# EAGLE schematic xio4 (EAGLE 9.4.2)

## Sheet 1 of 11: Block diagram
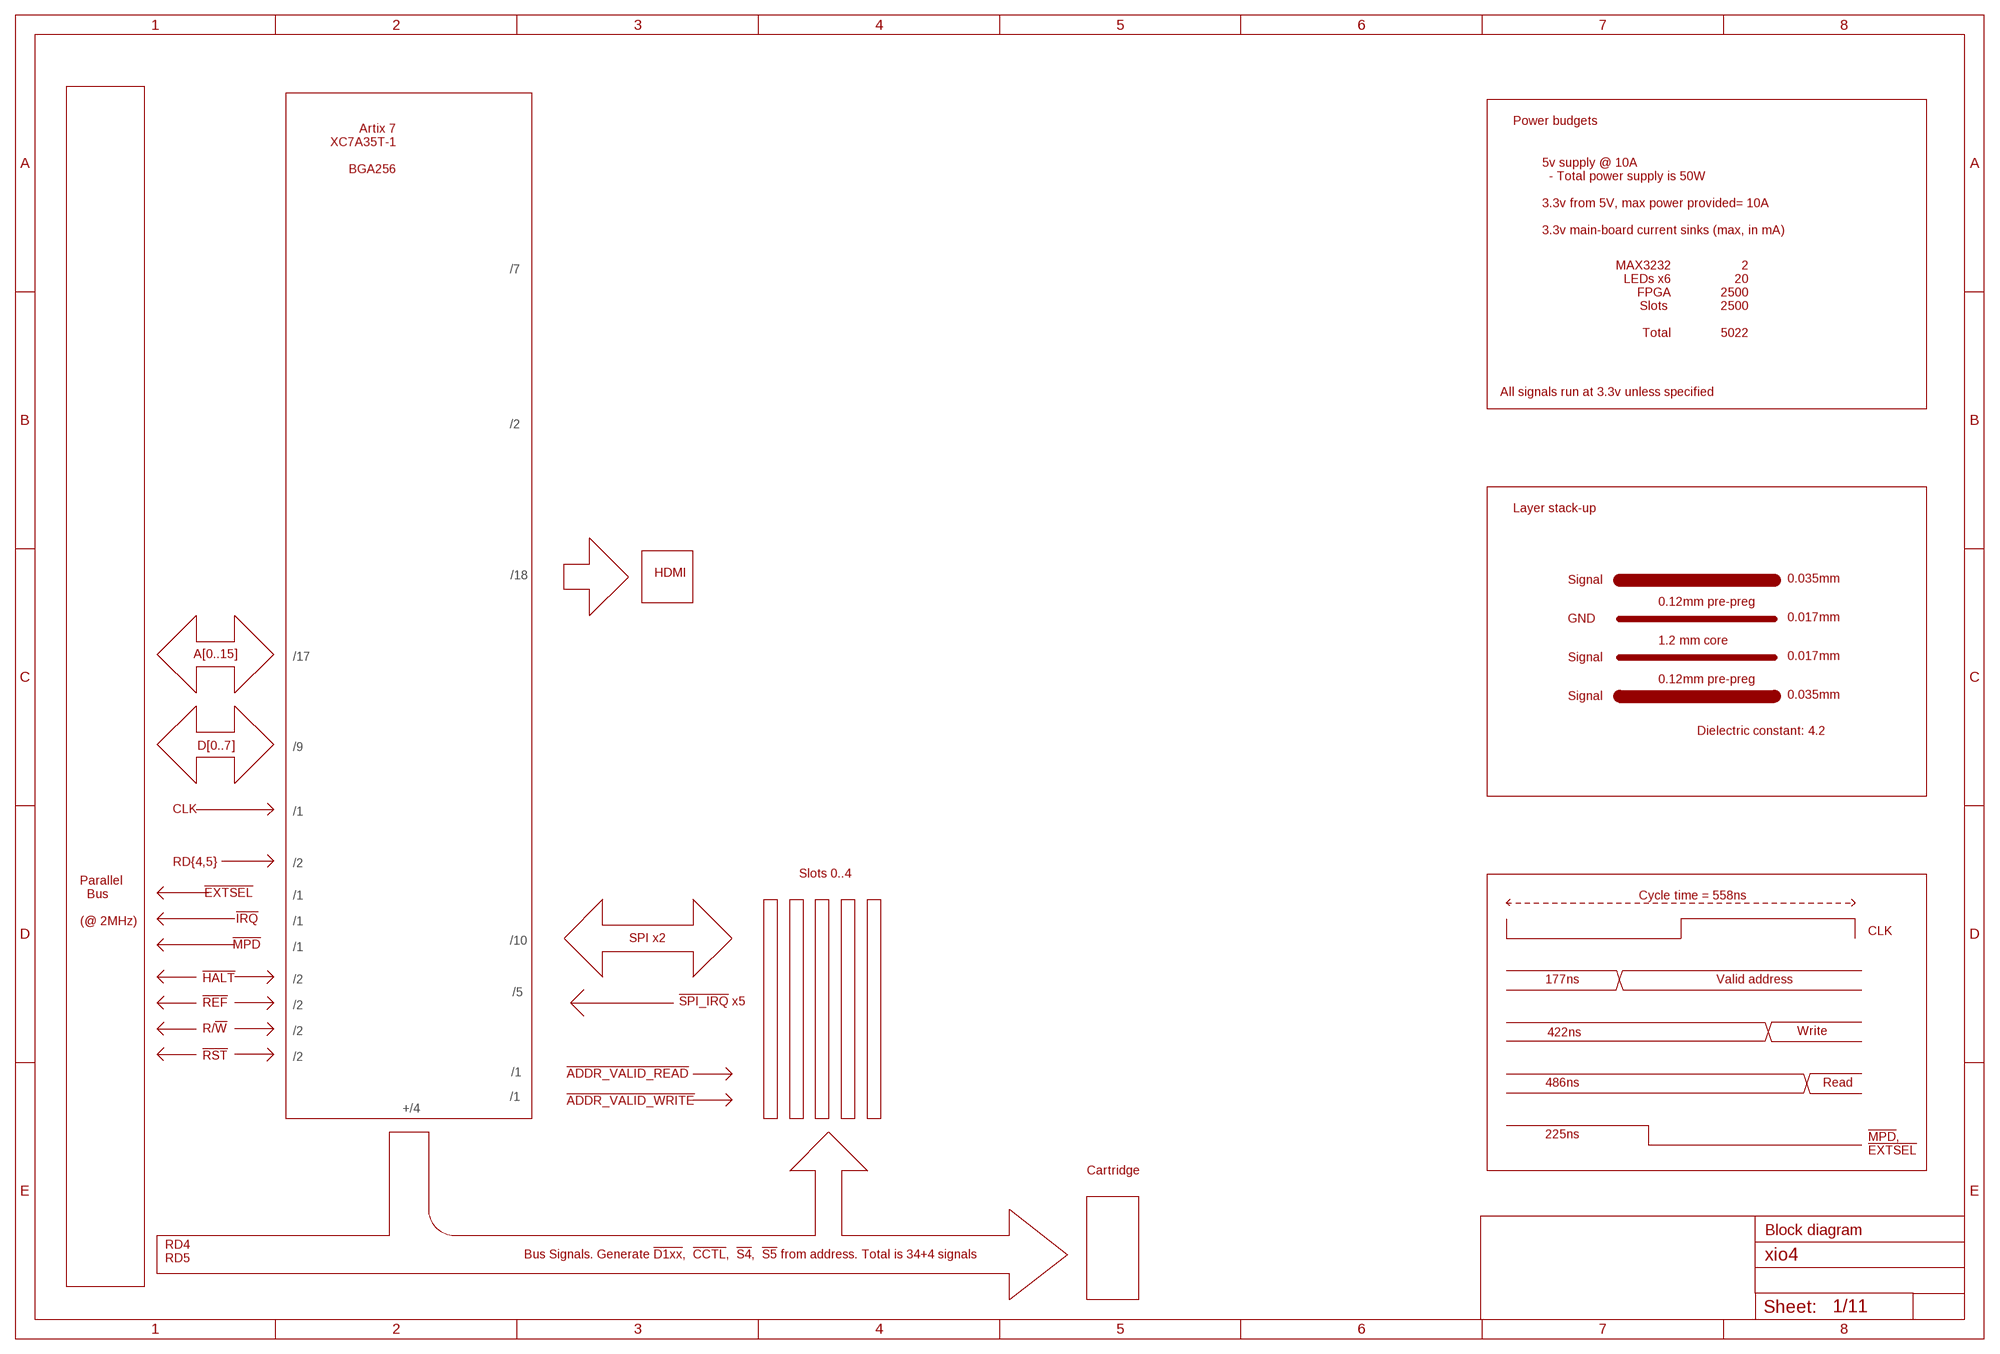
[diagram p0: schematic, sheet 1]

### Notes on the sheet
- Artix 7
      XC7A35T-1
  
   BGA256
- Power budgets
- 5v supply @ 10A
    - Total power supply is 50W
  
  3.3v from 5V, max power provided= 10A 
  
  3.3v main-board current sinks (max, in mA)
- MAX3232
  LEDs x6
  FPGA
  Slots 
  
  Total
- 2
  20
  2500
  2500
  
  5022
- /7
- All signals run at 3.3v unless specified
- /2
- Layer stack-up
- /18
- HDMI
- Signal | 0.035mm
- 0.12mm pre-preg
- GND | 0.017mm
- 1.2 mm core
- A[0..15] | /17 | Signal | 0.017mm
- 0.12mm pre-preg
- Signal | 0.035mm
- Dielectric constant: 4.2
- D[0..7] | /9
- CLK | /1
- RD{4,5} | /2
- Slots 0..4
- !EXTSEL!
- /1 | Cycle time = 558ns
- !IRQ!
- Parallel
    Bus
  
  (@ 2MHz)
- /1
- CLK
- !MPD! | SPI x2
- /10
- /1
- !HALT! | /2 | 177ns | Valid address
- /5
- !REF! | !SPI_IRQ! x5
- /2
- R/!W! | /2 | Write
- 422ns
- !RST! | /2
- /1 | !ADDR_VALID_READ!
- 486ns | Read
- /1
- !ADDR_VALID_WRITE!
- +/4
- 225ns
- !MPD!,
  !EXTSEL!
- Cartridge
- Block diagram
- Bus Signals. Generate !D1xx!,  !CCTL!,  !S4!,  !S5! from address. Total is 34+4 signals
- RD4
  RD5

## Sheet 2 of 11: High voltage signalling
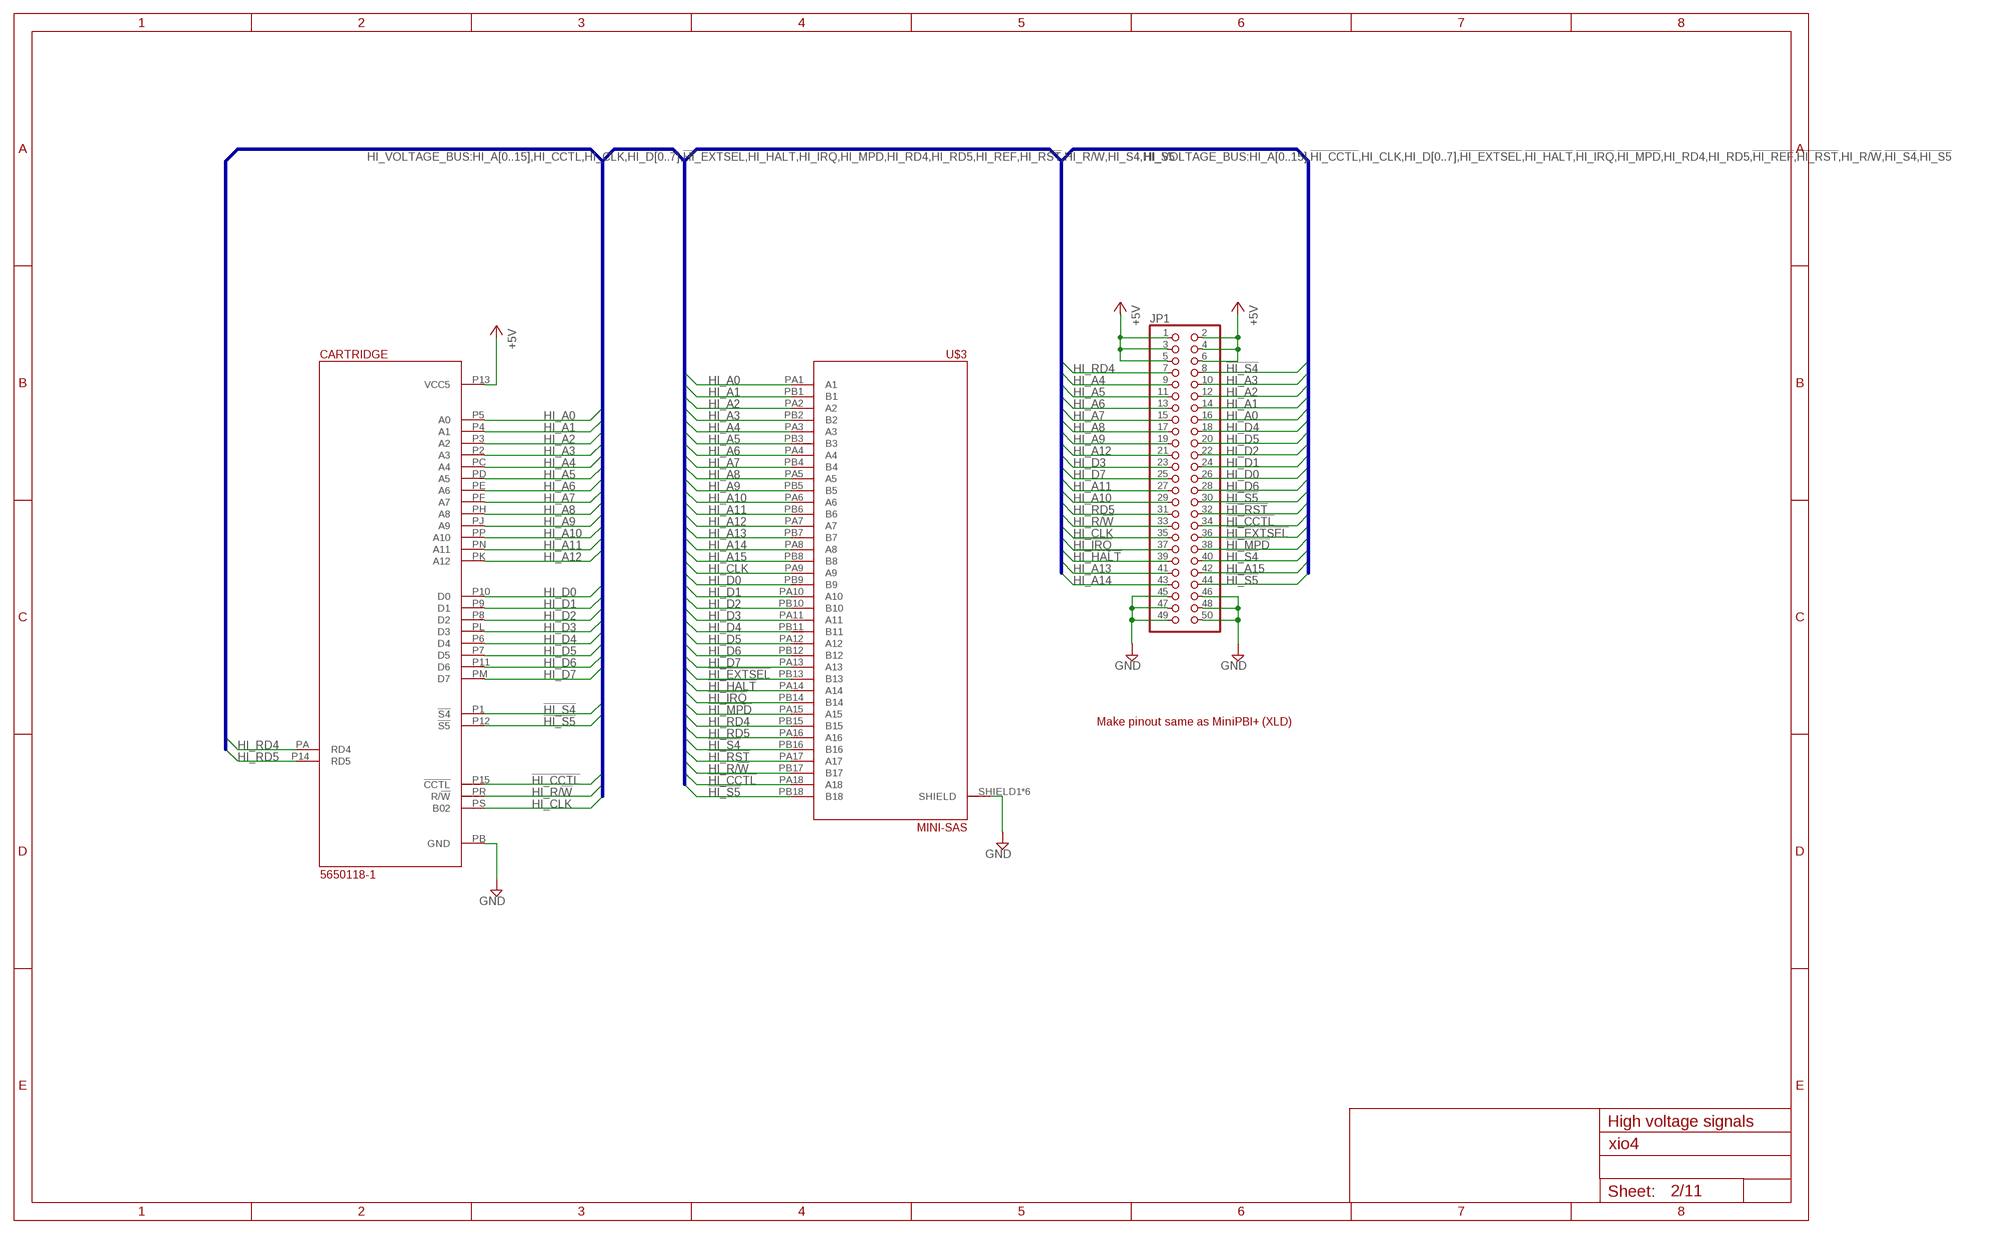
[diagram p1: schematic, sheet 2]

### Parts
CARTRIDGE  5650118-1  A8_CART  [A8_CART]
JP1  PINHD-2X25  [2X25]
U$3  MINI-SAS  [MINI-SAS]

### Nets
!HI_CCTL!: CARTRIDGE.P15(!CCTL!) JP1.34 U$3.PA18(A18)
!HI_EXTSEL!: JP1.36 U$3.PB13(B13) ; also sheet 3
!HI_HALT!: JP1.39 U$3.PA14(A14) ; also sheet 3
!HI_IRQ!: JP1.37 U$3.PB14(B14) ; also sheet 3
!HI_MPD!: JP1.38 U$3.PA15(A15) ; also sheet 3
!HI_RST!: JP1.32 U$3.PA17(A17) ; also sheet 3
!HI_S4!: CARTRIDGE.P1(!S4!) JP1.8 JP1.40 U$3.PB16(B16)
!HI_S5!: CARTRIDGE.P12(!S5!) JP1.30 JP1.44 U$3.PB18(B18)
+5V [Power]: CARTRIDGE.P13(VCC5) JP1.1 JP1.2 JP1.3 JP1.4 JP1.5 JP1.6 ; also sheet 3,4,5,6,7
GND: CARTRIDGE.PB(GND) JP1.45 JP1.46 JP1.47 JP1.48 JP1.49 JP1.50 U$3.SHIELD1(SHIELD) U$3.SHIELD2(SHIELD) U$3.SHIELD3(SHIELD) U$3.SHIELD4(SHIELD) U$3.SHIELD5(SHIELD) U$3.SHIELD6(SHIELD) ; also sheet 3,4,5,6,7,9
HI_A0: CARTRIDGE.P5(A0) JP1.16 U$3.PA1(A1) ; also sheet 3
HI_A1: CARTRIDGE.P4(A1) JP1.14 U$3.PB1(B1) ; also sheet 3
HI_A2: CARTRIDGE.P3(A2) JP1.12 U$3.PA2(A2) ; also sheet 3
HI_A3: CARTRIDGE.P2(A3) JP1.10 U$3.PB2(B2) ; also sheet 3
HI_A4: CARTRIDGE.PC(A4) JP1.9 U$3.PA3(A3) ; also sheet 3
HI_A5: CARTRIDGE.PD(A5) JP1.11 U$3.PB3(B3) ; also sheet 3
HI_A6: CARTRIDGE.PE(A6) JP1.13 U$3.PA4(A4) ; also sheet 3
HI_A7: CARTRIDGE.PF(A7) JP1.15 U$3.PB4(B4) ; also sheet 3
HI_A8: CARTRIDGE.PH(A8) JP1.17 U$3.PA5(A5) ; also sheet 3
HI_A9: CARTRIDGE.PJ(A9) JP1.19 U$3.PB5(B5) ; also sheet 3
HI_A10: CARTRIDGE.PP(A10) JP1.29 U$3.PA6(A6) ; also sheet 3
HI_A11: CARTRIDGE.PN(A11) JP1.27 U$3.PB6(B6) ; also sheet 3
HI_A12: CARTRIDGE.PK(A12) JP1.21 U$3.PA7(A7) ; also sheet 3
HI_A13: JP1.41 U$3.PB7(B7) ; also sheet 3
HI_A14: JP1.43 U$3.PA8(A8) ; also sheet 3
HI_A15: JP1.42 U$3.PB8(B8) ; also sheet 3
HI_CLK: CARTRIDGE.PS(B02) JP1.35 U$3.PA9(A9) ; also sheet 3
HI_D0: CARTRIDGE.P10(D0) JP1.26 U$3.PB9(B9) ; also sheet 3
HI_D1: CARTRIDGE.P9(D1) JP1.24 U$3.PA10(A10) ; also sheet 3
HI_D2: CARTRIDGE.P8(D2) JP1.22 U$3.PB10(B10) ; also sheet 3
HI_D3: CARTRIDGE.PL(D3) JP1.23 U$3.PA11(A11) ; also sheet 3
HI_D4: CARTRIDGE.P6(D4) JP1.18 U$3.PB11(B11) ; also sheet 3
HI_D5: CARTRIDGE.P7(D5) JP1.20 U$3.PA12(A12) ; also sheet 3
HI_D6: CARTRIDGE.P11(D6) JP1.28 U$3.PB12(B12) ; also sheet 3
HI_D7: CARTRIDGE.PM(D7) JP1.25 U$3.PA13(A13) ; also sheet 3
HI_R/!W!: CARTRIDGE.PR(R/!W!) JP1.33 U$3.PB17(B17) ; also sheet 3
HI_RD4: CARTRIDGE.PA(RD4) JP1.7 U$3.PB15(B15) ; also sheet 3
HI_RD5: CARTRIDGE.P14(RD5) JP1.31 U$3.PA16(A16) ; also sheet 3

### Buses
HI_VOLTAGE_BUS:HI_A[0..15],!HI_CCTL!,HI_CLK,HI_D[0..7],!HI_EXTSEL!,!HI_HALT!,!HI_IRQ!,!HI_MPD!,HI_RD4,HI_RD5,!HI_REF!,!HI_RST!,HI_R/!W!,!HI_S4!,!HI_S5!

### Notes on the sheet
- Make pinout same as MiniPBI+ (XLD)
- High voltage signals

## Sheet 3 of 11: Level changers
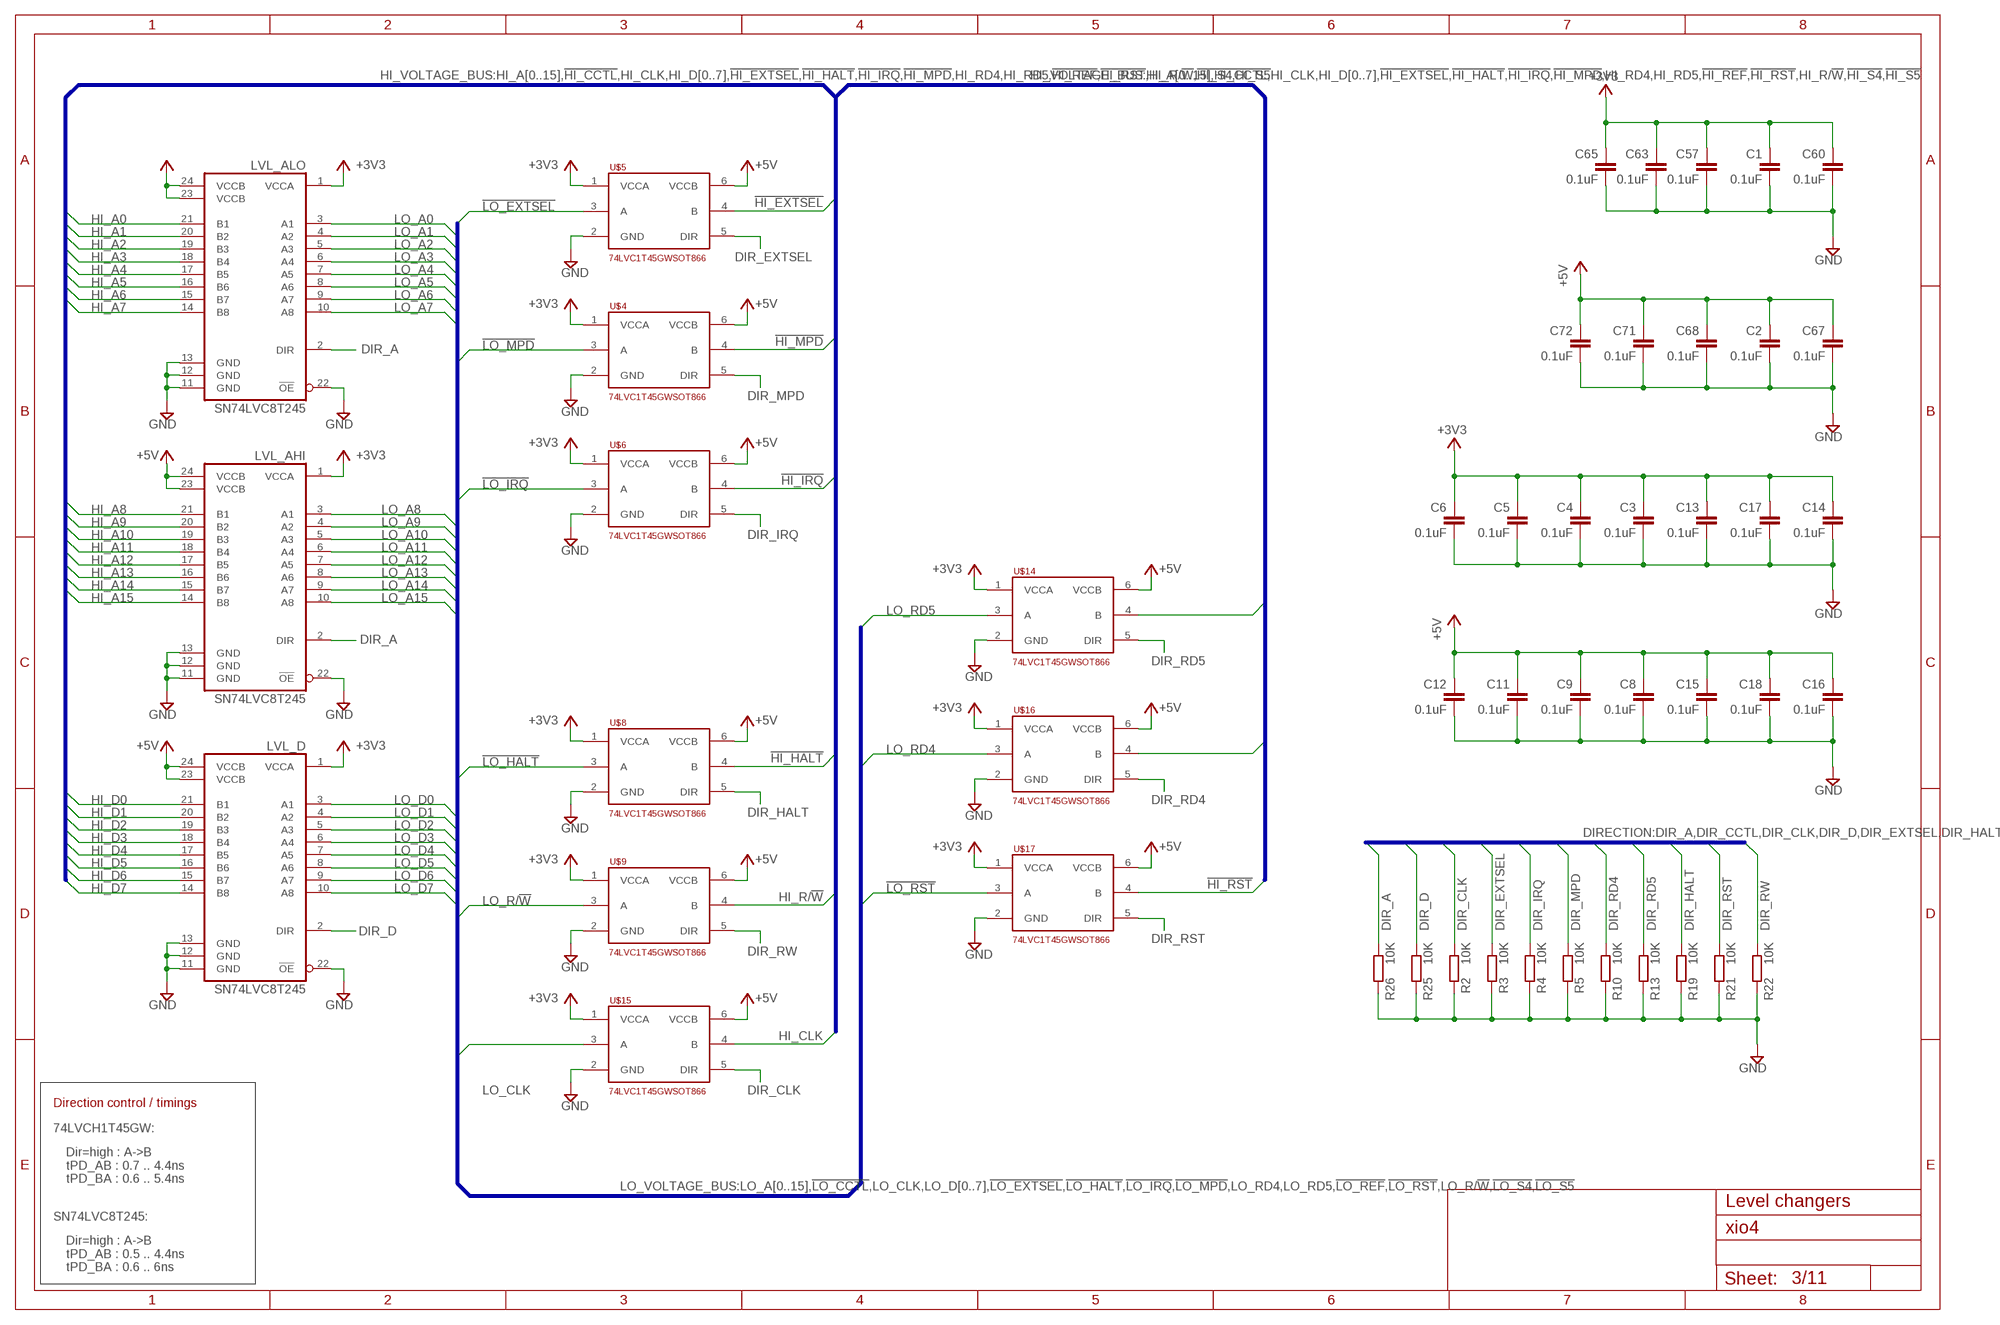
[diagram p2: schematic, sheet 3, part 1 of 2]
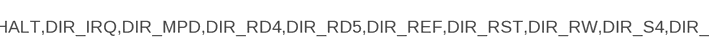
[diagram p3: schematic, sheet 3, part 2 of 2]

### Parts
C1  0.1uF  C-EUC0201  [C0201]
C2  0.1uF  C-EUC0201  [C0201]
C3  0.1uF  C-EUC0201  [C0201]
C4  0.1uF  C-EUC0201  [C0201]
C5  0.1uF  C-EUC0201  [C0201]
C6  0.1uF  C-EUC0201  [C0201]
C8  0.1uF  C-EUC0201  [C0201]
C9  0.1uF  C-EUC0201  [C0201]
C11  0.1uF  C-EUC0201  [C0201]
C12  0.1uF  C-EUC0201  [C0201]
C13  0.1uF  C-EUC0201  [C0201]
C14  0.1uF  C-EUC0201  [C0201]
C15  0.1uF  C-EUC0201  [C0201]
C16  0.1uF  C-EUC0201  [C0201]
C17  0.1uF  C-EUC0201  [C0201]
C18  0.1uF  C-EUC0201  [C0201]
C57  0.1uF  C-EUC0201  [C0201]
C60  0.1uF  C-EUC0201  [C0201]
C63  0.1uF  C-EUC0201  [C0201]
C65  0.1uF  C-EUC0201  [C0201]
C67  0.1uF  C-EUC0201  [C0201]
C68  0.1uF  C-EUC0201  [C0201]
C71  0.1uF  C-EUC0201  [C0201]
C72  0.1uF  C-EUC0201  [C0201]
LVL_AHI  SN74LVC8T245  [TSSOP24]
LVL_ALO  SN74LVC8T245  [TSSOP24]
LVL_D  SN74LVC8T245  [TSSOP24]
R2  10K  R-EU_R0201  [R0201]
R3  10K  R-EU_R0201  [R0201]
R4  10K  R-EU_R0201  [R0201]
R5  10K  R-EU_R0201  [R0201]
R10  10K  R-EU_R0201  [R0201]
R13  10K  R-EU_R0201  [R0201]
R19  10K  R-EU_R0201  [R0201]
R21  10K  R-EU_R0201  [R0201]
R22  10K  R-EU_R0201  [R0201]
R25  10K  R-EU_R0201  [R0201]
R26  10K  R-EU_R0201  [R0201]
U$4  74LVC1T45GWSOT866  [SOT886]
U$5  74LVC1T45GWSOT866  [SOT886]
U$6  74LVC1T45GWSOT866  [SOT886]
U$8  74LVC1T45GWSOT866  [SOT886]
U$9  74LVC1T45GWSOT866  [SOT886]
U$14  74LVC1T45GWSOT866  [SOT886]
U$15  74LVC1T45GWSOT866  [SOT886]
U$16  74LVC1T45GWSOT866  [SOT886]
U$17  74LVC1T45GWSOT866  [SOT886]

### Nets
!HI_EXTSEL!: U$5.4(B) ; also sheet 2
!HI_HALT!: U$8.4(B) ; also sheet 2
!HI_IRQ!: U$6.4(B) ; also sheet 2
!HI_MPD!: U$4.4(B) ; also sheet 2
!HI_RST!: U$17.4(B) ; also sheet 2
!LO_EXTSEL!: U$5.3(A) ; also sheet 5,6,7
!LO_HALT!: U$8.3(A) ; also sheet 5,6,7
!LO_IRQ!: U$6.3(A) ; also sheet 5,6,7
!LO_MPD!: U$4.3(A) ; also sheet 5,6,7
!LO_RST!: U$17.3(A) ; also sheet 5,6,7
+3V3 [lcd]: C1.1 C3.1 C4.1 C5.1 C6.1 C13.1 C14.1 C17.1 C57.1 C60.1 C63.1 C65.1 LVL_AHI.1(VCCA) LVL_ALO.1(VCCA) LVL_D.1(VCCA) U$4.1(VCCA) U$5.1(VCCA) U$6.1(VCCA) U$8.1(VCCA) U$9.1(VCCA) U$14.1(VCCA) U$15.1(VCCA) U$16.1(VCCA) U$17.1(VCCA) ; also sheet 4,5,6,7,9
+5V [Power]: C2.1 C8.1 C9.1 C11.1 C12.1 C15.1 C16.1 C18.1 C67.1 C68.1 C71.1 C72.1 LVL_AHI.23(VCCB) LVL_AHI.24(VCCB) LVL_ALO.23(VCCB) LVL_ALO.24(VCCB) LVL_D.23(VCCB) LVL_D.24(VCCB) U$4.6(VCCB) U$5.6(VCCB) U$6.6(VCCB) U$8.6(VCCB) U$9.6(VCCB) U$14.6(VCCB) U$15.6(VCCB) U$16.6(VCCB) U$17.6(VCCB) ; also sheet 2,4,5,6,7
DIR_A: LVL_AHI.2(DIR) LVL_ALO.2(DIR) R26.1
DIR_CLK: R2.1 U$15.5(DIR)
DIR_D: LVL_D.2(DIR) R25.1
DIR_EXTSEL: R3.1 U$5.5(DIR)
DIR_HALT: R19.1 U$8.5(DIR)
DIR_IRQ: R4.1 U$6.5(DIR)
DIR_MPD: R5.1 U$4.5(DIR)
DIR_RD4: R10.1 U$16.5(DIR)
DIR_RD5: R13.1 U$14.5(DIR)
DIR_RST: R21.1 U$17.5(DIR)
DIR_RW: R22.1 U$9.5(DIR)
GND: C1.2 C2.2 C3.2 C4.2 C5.2 C6.2 C8.2 C9.2 C11.2 C12.2 C13.2 C14.2 C15.2 C16.2 C17.2 C18.2 C57.2 C60.2 C63.2 C65.2 C67.2 C68.2 C71.2 C72.2 LVL_AHI.11(GND) LVL_AHI.12(GND) LVL_AHI.13(GND) LVL_AHI.22(!OE!) LVL_ALO.11(GND) LVL_ALO.12(GND) LVL_ALO.13(GND) LVL_ALO.22(!OE!) LVL_D.11(GND) LVL_D.12(GND) LVL_D.13(GND) LVL_D.22(!OE!) R2.2 R3.2 R4.2 R5.2 R10.2 R13.2 R19.2 R21.2 R22.2 R25.2 R26.2 U$4.2(GND) U$5.2(GND) U$6.2(GND) U$8.2(GND) U$9.2(GND) U$14.2(GND) U$15.2(GND) U$16.2(GND) U$17.2(GND) ; also sheet 2,4,5,6,7,9
HI_A0: LVL_ALO.21(B1) ; also sheet 2
HI_A1: LVL_ALO.20(B2) ; also sheet 2
HI_A2: LVL_ALO.19(B3) ; also sheet 2
HI_A3: LVL_ALO.18(B4) ; also sheet 2
HI_A4: LVL_ALO.17(B5) ; also sheet 2
HI_A5: LVL_ALO.16(B6) ; also sheet 2
HI_A6: LVL_ALO.15(B7) ; also sheet 2
HI_A7: LVL_ALO.14(B8) ; also sheet 2
HI_A8: LVL_AHI.21(B1) ; also sheet 2
HI_A9: LVL_AHI.20(B2) ; also sheet 2
HI_A10: LVL_AHI.19(B3) ; also sheet 2
HI_A11: LVL_AHI.18(B4) ; also sheet 2
HI_A12: LVL_AHI.17(B5) ; also sheet 2
HI_A13: LVL_AHI.16(B6) ; also sheet 2
HI_A14: LVL_AHI.15(B7) ; also sheet 2
HI_A15: LVL_AHI.14(B8) ; also sheet 2
HI_CLK: U$15.4(B) ; also sheet 2
HI_D0: LVL_D.21(B1) ; also sheet 2
HI_D1: LVL_D.20(B2) ; also sheet 2
HI_D2: LVL_D.19(B3) ; also sheet 2
HI_D3: LVL_D.18(B4) ; also sheet 2
HI_D4: LVL_D.17(B5) ; also sheet 2
HI_D5: LVL_D.16(B6) ; also sheet 2
HI_D6: LVL_D.15(B7) ; also sheet 2
HI_D7: LVL_D.14(B8) ; also sheet 2
HI_R/!W!: U$9.4(B) ; also sheet 2
HI_RD4: U$16.4(B) ; also sheet 2
HI_RD5: U$14.4(B) ; also sheet 2
LO_A0: LVL_ALO.3(A1) ; also sheet 5,6,7
LO_A1: LVL_ALO.4(A2) ; also sheet 5,6,7
LO_A2: LVL_ALO.5(A3) ; also sheet 5,6,7
LO_A3: LVL_ALO.6(A4) ; also sheet 5,6,7
LO_A4: LVL_ALO.7(A5) ; also sheet 5,6,7
LO_A5: LVL_ALO.8(A6) ; also sheet 5,6,7
LO_A6: LVL_ALO.9(A7) ; also sheet 5,6,7
LO_A7: LVL_ALO.10(A8) ; also sheet 5,6,7
LO_A8: LVL_AHI.3(A1) ; also sheet 5,6,7
LO_A9: LVL_AHI.4(A2) ; also sheet 5,6,7
LO_A10: LVL_AHI.5(A3) ; also sheet 5,6,7
LO_A11: LVL_AHI.6(A4) ; also sheet 5,6,7
LO_A12: LVL_AHI.7(A5) ; also sheet 5,6,7
LO_A13: LVL_AHI.8(A6) ; also sheet 5,6,7
LO_A14: LVL_AHI.9(A7) ; also sheet 5,6,7
LO_A15: LVL_AHI.10(A8) ; also sheet 5,6,7
LO_CLK: U$15.3(A) ; also sheet 5,6,7
LO_D0: LVL_D.3(A1) ; also sheet 5,6,7
LO_D1: LVL_D.4(A2) ; also sheet 5,6,7
LO_D2: LVL_D.5(A3) ; also sheet 5,6,7
LO_D3: LVL_D.6(A4) ; also sheet 5,6,7
LO_D4: LVL_D.7(A5) ; also sheet 5,6,7
LO_D5: LVL_D.8(A6) ; also sheet 5,6,7
LO_D6: LVL_D.9(A7) ; also sheet 5,6,7
LO_D7: LVL_D.10(A8) ; also sheet 5,6,7
LO_R/!W!: U$9.3(A) ; also sheet 5,6,7
LO_RD4: U$16.3(A) ; also sheet 5,6,7
LO_RD5: U$14.3(A) ; also sheet 5,6,7

### Buses
HI_VOLTAGE_BUS:HI_A[0..15],!HI_CCTL!,HI_CLK,HI_D[0..7],!HI_EXTSEL!,!HI_HALT!,!HI_IRQ!,!HI_MPD!,HI_RD4,HI_RD5,!HI_REF!,!HI_RST!,HI_R/!W!,!HI_S4!,!HI_S5!
LO_VOLTAGE_BUS:LO_A[0..15],!LO_CCTL!,LO_CLK,LO_D[0..7],!LO_EXTSEL!,!LO_HALT!,!LO_IRQ!,!LO_MPD!,LO_RD4,LO_RD5,!LO_REF!,!LO_RST!,LO_R/!W!,!LO_S4!,!LO_S5!
DIRECTION:DIR_A,DIR_CCTL,DIR_CLK,DIR_D,DIR_EXTSEL,DIR_HALT,DIR_IRQ,DIR_MPD,DIR_RD4,DIR_RD5,DIR_REF,DIR_RST,DIR_RW,DIR_S4,DIR_S5

### Notes on the sheet
- Direction control / timings
- 74LVCH1T45GW:
- Dir=high : A->B
  tPD_AB : 0.7 .. 4.4ns
  tPD_BA : 0.6 .. 5.4ns
- Level changers
- SN74LVC8T245:
- Dir=high : A->B
  tPD_AB : 0.5 .. 4.4ns
  tPD_BA : 0.6 .. 6ns

## Sheet 4 of 11: FPGA
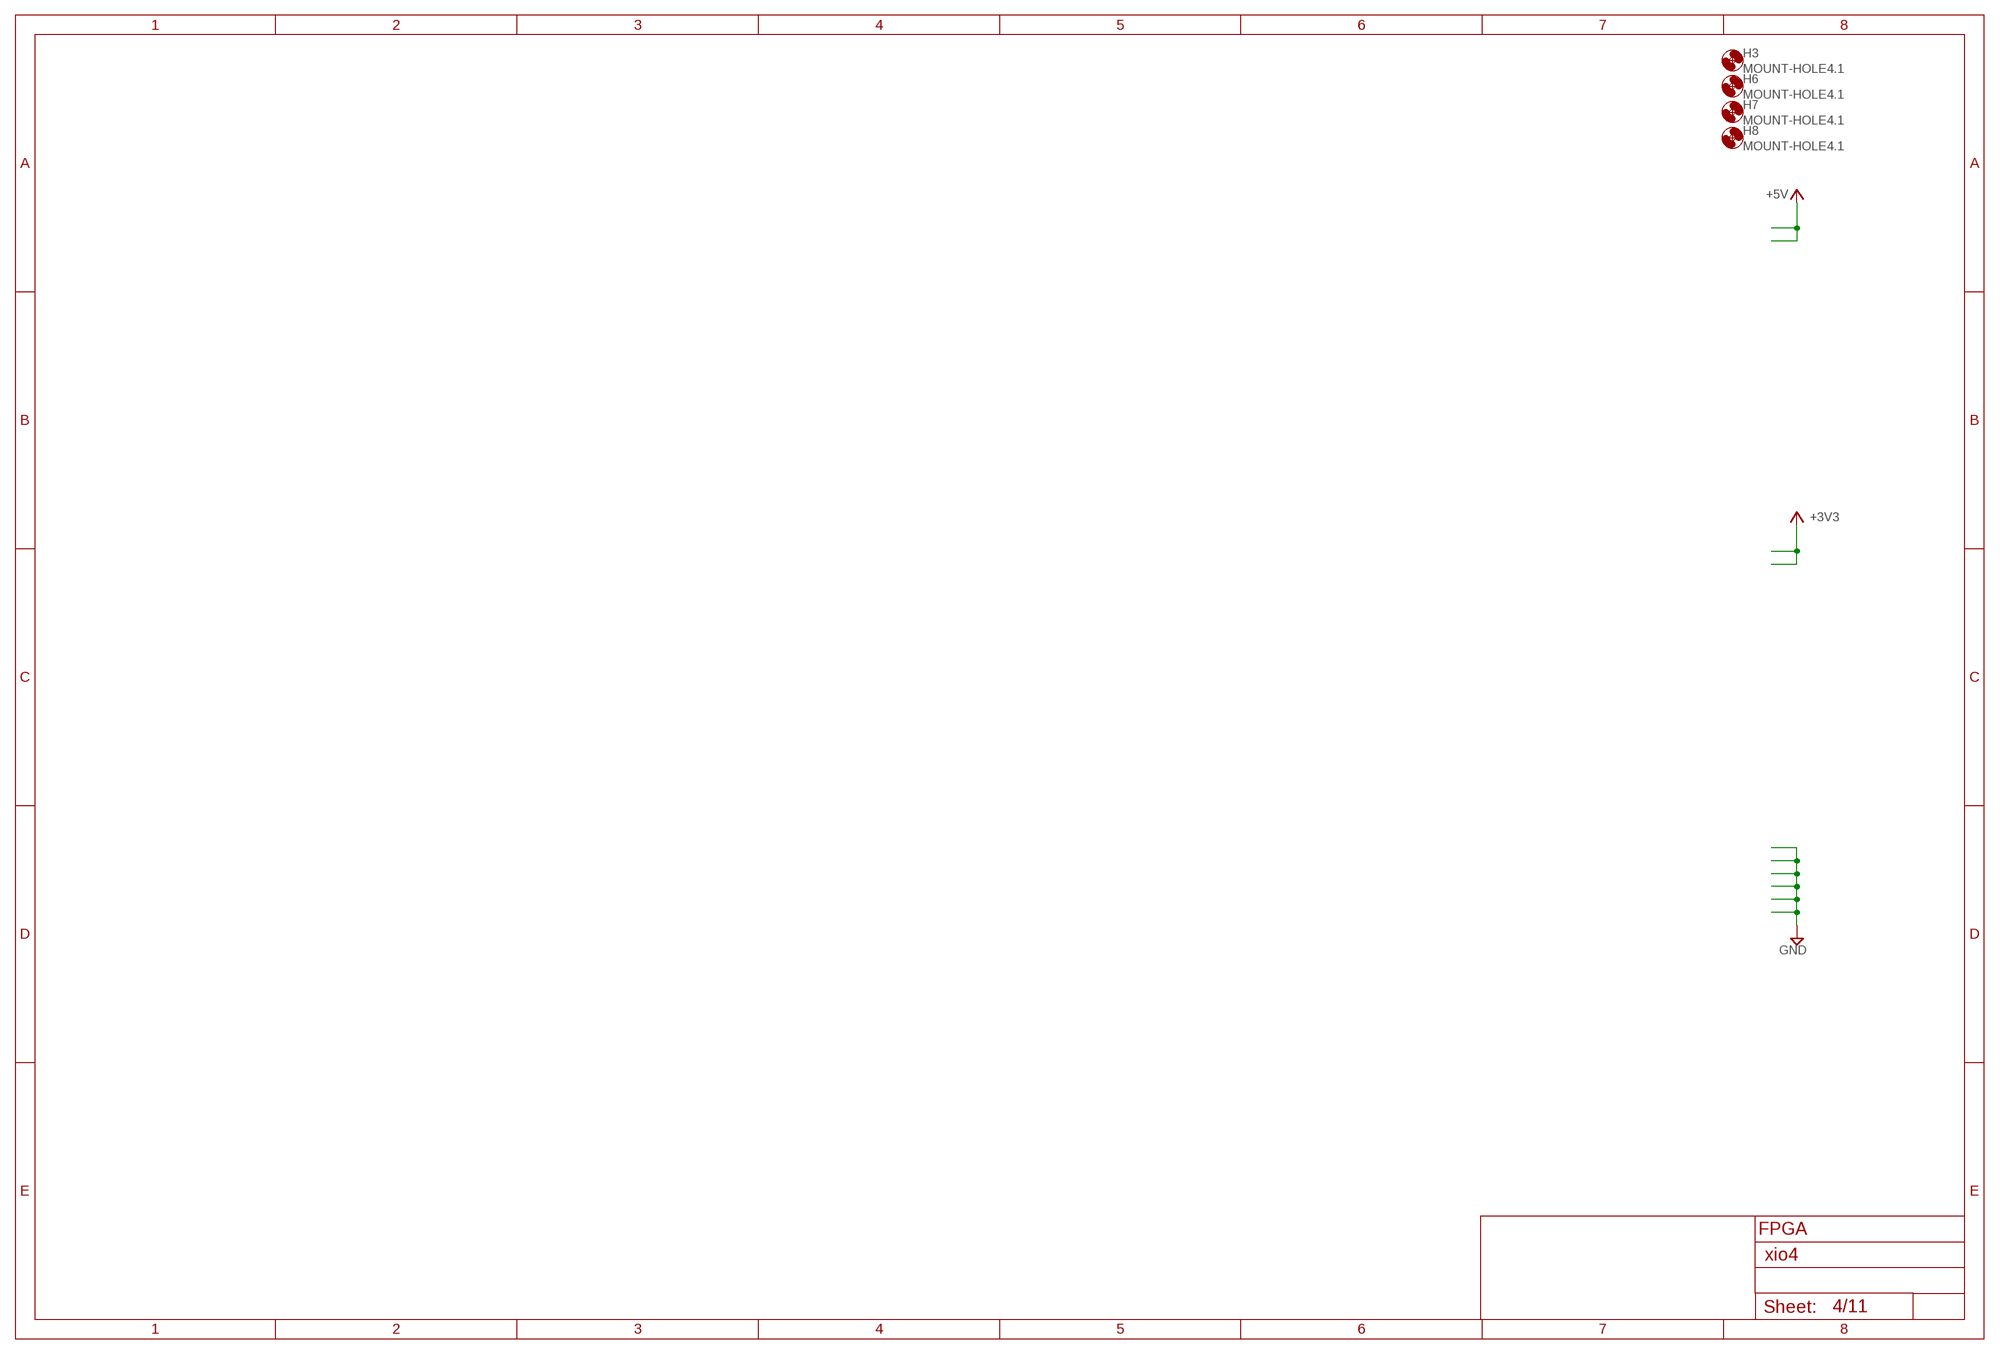
[diagram p4: schematic, sheet 4]

### Parts
H3  MOUNT-HOLE4.1  [4,1]
H6  MOUNT-HOLE4.1  [4,1]
H7  MOUNT-HOLE4.1  [4,1]
H8  MOUNT-HOLE4.1  [4,1]

### Notes on the sheet
- FPGA

## Sheet 5 of 11: Expansion slots 0 & 1
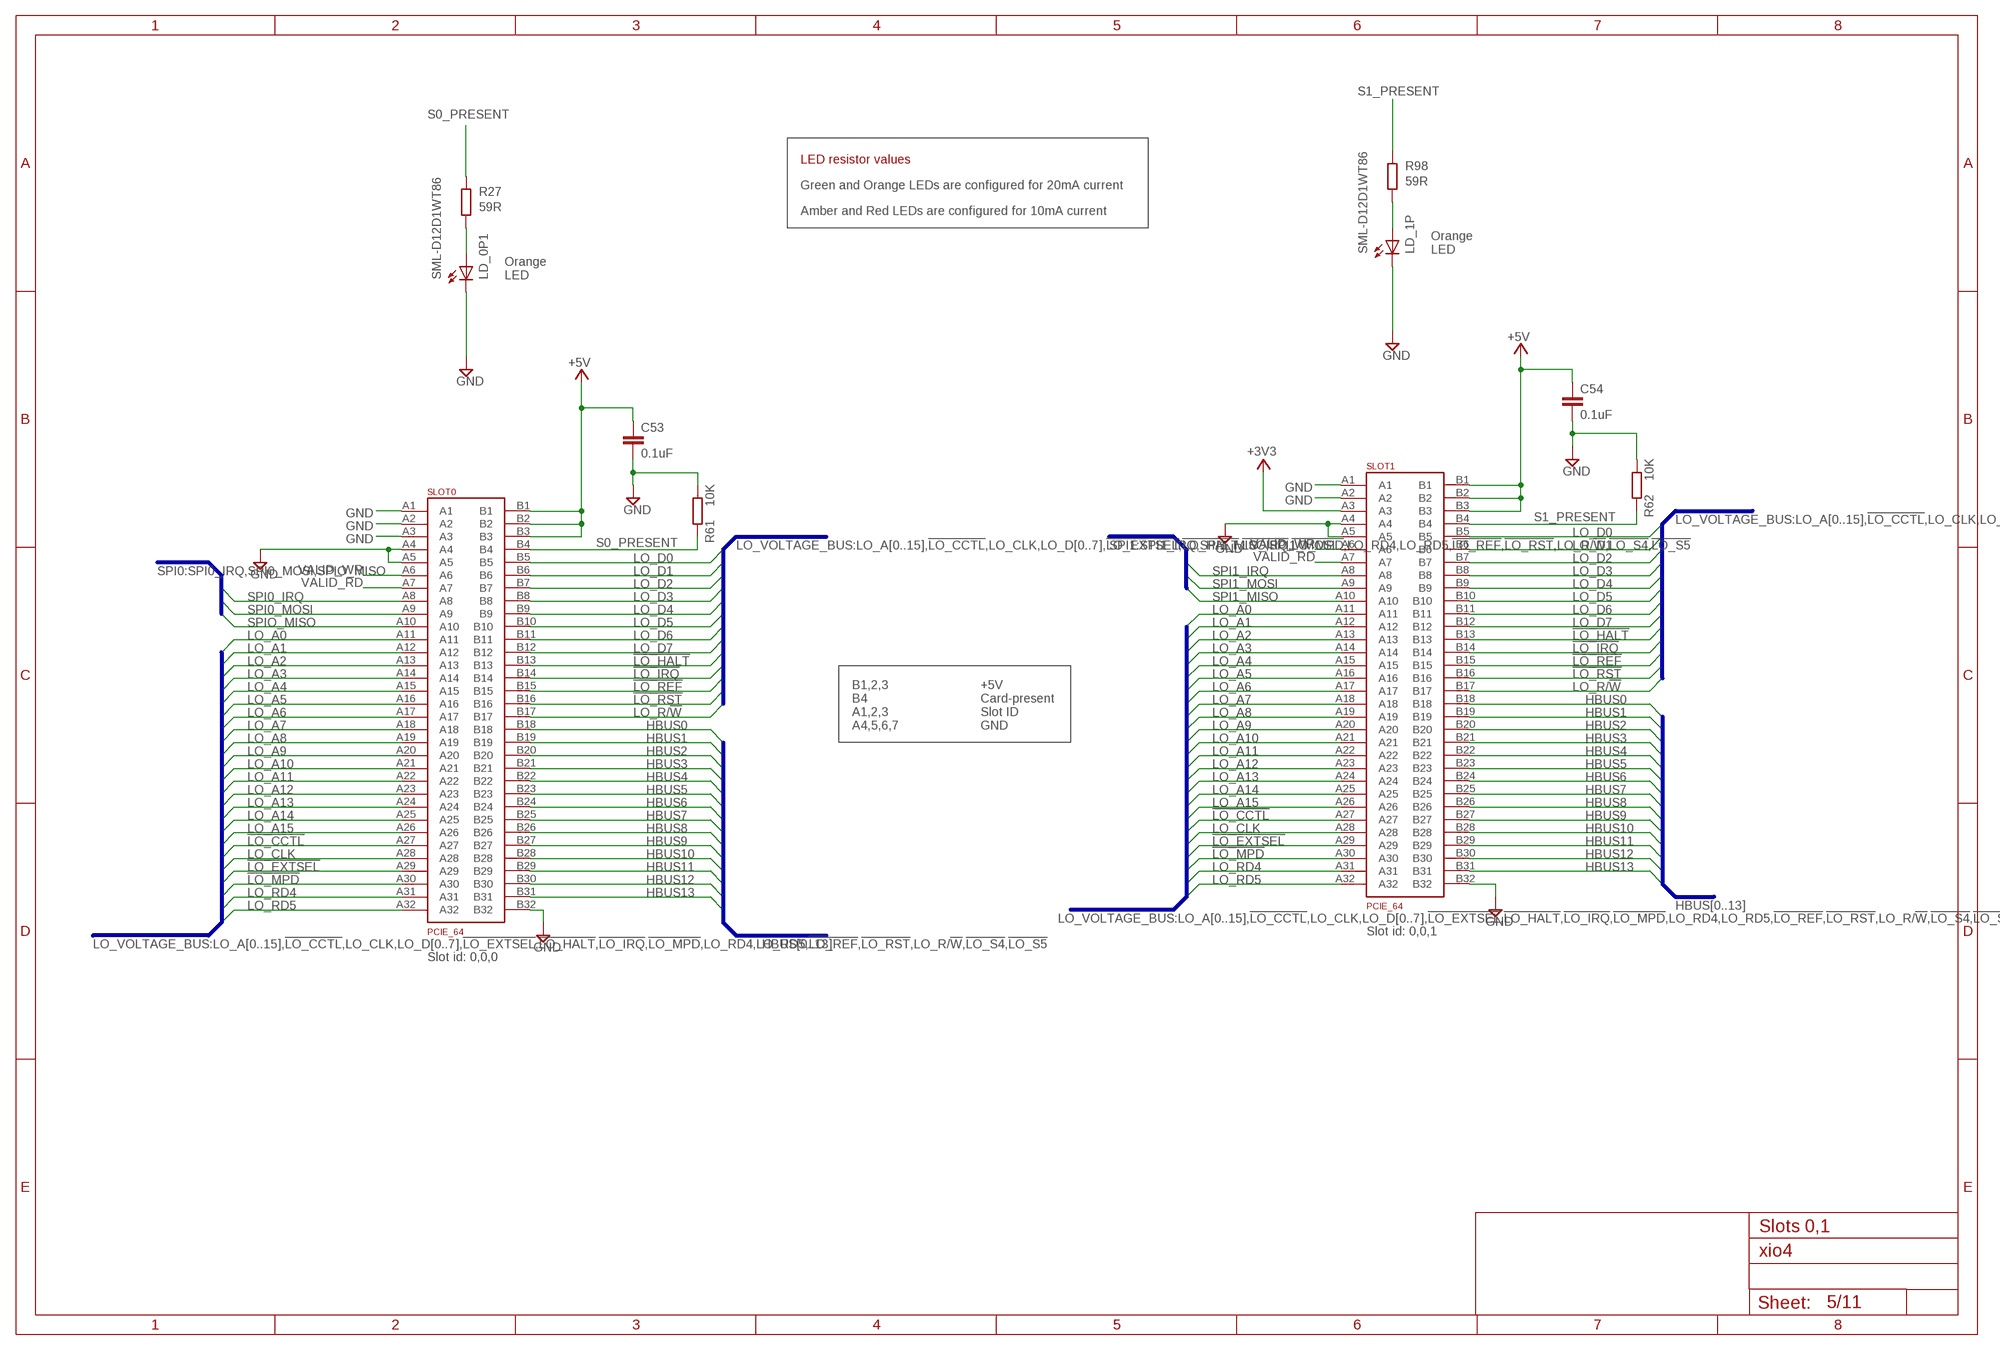
[diagram p5: schematic, sheet 5, part 1 of 2]
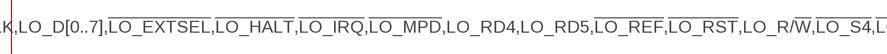
[diagram p6: schematic, sheet 5, part 2 of 2]

### Parts
C53  0.1uF  C-EUC0201  [C0201]
C54  0.1uF  C-EUC0201  [C0201]
LD_0P1  SML-D12D1WT86  LEDCHIPLED_0603  [CHIPLED_0603]
LD_1P  SML-D12D1WT86  LEDCHIPLED_0603  [CHIPLED_0603]
R27  59R  R-EU_R0402  [R0402]
R61  10K  R-EU_R0201  [R0201]
R62  10K  R-EU_R0201  [R0201]
R98  59R  R-EU_R0402  [R0402]
SLOT0  PCIE_64  [PCI-E_64]
SLOT1  PCIE_64  [PCI-E_64]

### Nets
!LO_CCTL!: SLOT0.A27 SLOT1.A27 ; also sheet 6,7
!LO_EXTSEL!: SLOT0.A29 SLOT1.A29 ; also sheet 3,6,7
!LO_HALT!: SLOT0.B13 SLOT1.B13 ; also sheet 3,6,7
!LO_IRQ!: SLOT0.B14 SLOT1.B14 ; also sheet 3,6,7
!LO_MPD!: SLOT0.A30 SLOT1.A30 ; also sheet 3,6,7
!LO_REF!: SLOT0.B15 SLOT1.B15 ; also sheet 6,7
!LO_RST!: SLOT0.B16 SLOT1.B16 ; also sheet 3,6,7
+3V3 [lcd]: SLOT1.A3 ; also sheet 3,4,6,7,9
+5V [Power]: C53.1 C54.1 SLOT0.B1 SLOT0.B2 SLOT0.B3 SLOT1.B1 SLOT1.B2 SLOT1.B3 ; also sheet 2,3,4,6,7
GND: C53.2 C54.2 LD_0P1.C LD_1P.C R61.1 R62.1 SLOT0.A1 SLOT0.A2 SLOT0.A3 SLOT0.A4 SLOT0.A5 SLOT0.B32 SLOT1.A1 SLOT1.A2 SLOT1.A4 SLOT1.A5 SLOT1.B32 ; also sheet 2,3,4,6,7,9
HBUS0: SLOT0.B18 SLOT1.B18 ; also sheet 6,7
HBUS1: SLOT0.B19 SLOT1.B19 ; also sheet 6,7
HBUS2: SLOT0.B20 SLOT1.B20 ; also sheet 6,7
HBUS3: SLOT0.B21 SLOT1.B21 ; also sheet 6,7
HBUS4: SLOT0.B22 SLOT1.B22 ; also sheet 6,7
HBUS5: SLOT0.B23 SLOT1.B23 ; also sheet 6,7
HBUS6: SLOT0.B24 SLOT1.B24 ; also sheet 6,7
HBUS7: SLOT0.B25 SLOT1.B25 ; also sheet 6,7
HBUS8: SLOT0.B26 SLOT1.B26 ; also sheet 6,7
HBUS9: SLOT0.B27 SLOT1.B27 ; also sheet 6,7
HBUS10: SLOT0.B28 SLOT1.B28 ; also sheet 6,7
HBUS11: SLOT0.B29 SLOT1.B29 ; also sheet 6,7
HBUS12: SLOT0.B30 SLOT1.B30 ; also sheet 6,7
HBUS13: SLOT0.B31 SLOT1.B31 ; also sheet 6,7
LO_A0: SLOT0.A11 SLOT1.A11 ; also sheet 3,6,7
LO_A1: SLOT0.A12 SLOT1.A12 ; also sheet 3,6,7
LO_A2: SLOT0.A13 SLOT1.A13 ; also sheet 3,6,7
LO_A3: SLOT0.A14 SLOT1.A14 ; also sheet 3,6,7
LO_A4: SLOT0.A15 SLOT1.A15 ; also sheet 3,6,7
LO_A5: SLOT0.A16 SLOT1.A16 ; also sheet 3,6,7
LO_A6: SLOT0.A17 SLOT1.A17 ; also sheet 3,6,7
LO_A7: SLOT0.A18 SLOT1.A18 ; also sheet 3,6,7
LO_A8: SLOT0.A19 SLOT1.A19 ; also sheet 3,6,7
LO_A9: SLOT0.A20 SLOT1.A20 ; also sheet 3,6,7
LO_A10: SLOT0.A21 SLOT1.A21 ; also sheet 3,6,7
LO_A11: SLOT0.A22 SLOT1.A22 ; also sheet 3,6,7
LO_A12: SLOT0.A23 SLOT1.A23 ; also sheet 3,6,7
LO_A13: SLOT0.A24 SLOT1.A24 ; also sheet 3,6,7
LO_A14: SLOT0.A25 SLOT1.A25 ; also sheet 3,6,7
LO_A15: SLOT0.A26 SLOT1.A26 ; also sheet 3,6,7
LO_CLK: SLOT0.A28 SLOT1.A28 ; also sheet 3,6,7
LO_D0: SLOT0.B5 SLOT1.B5 ; also sheet 3,6,7
LO_D1: SLOT0.B6 SLOT1.B6 ; also sheet 3,6,7
LO_D2: SLOT0.B7 SLOT1.B7 ; also sheet 3,6,7
LO_D3: SLOT0.B8 SLOT1.B8 ; also sheet 3,6,7
LO_D4: SLOT0.B9 SLOT1.B9 ; also sheet 3,6,7
LO_D5: SLOT0.B10 SLOT1.B10 ; also sheet 3,6,7
LO_D6: SLOT0.B11 SLOT1.B11 ; also sheet 3,6,7
LO_D7: SLOT0.B12 SLOT1.B12 ; also sheet 3,6,7
LO_R/!W!: SLOT0.B17 SLOT1.B17 ; also sheet 3,6,7
LO_RD4: SLOT0.A31 SLOT1.A31 ; also sheet 3,6,7
LO_RD5: SLOT0.A32 SLOT1.A32 ; also sheet 3,6,7
N$1: LD_0P1.A R27.2
N$91: LD_1P.A R98.2
S0_PRESENT: R27.1 R61.2 SLOT0.B4
S1_PRESENT: R62.2 R98.1 SLOT1.B4
SPI0_IRQ: SLOT0.A8
SPI0_MOSI: SLOT0.A9
SPI1_IRQ: SLOT1.A8
SPI1_MISO: SLOT1.A10
SPI1_MOSI: SLOT1.A9
SPIO_MISO: SLOT0.A10
VALID_RD: SLOT0.A7 SLOT1.A7 ; also sheet 6,7
VALID_WR: SLOT0.A6 SLOT1.A6 ; also sheet 6,7

### Buses
SPI0:SPI0_IRQ,SPI0_MOSI,SPIO_MISO
SPI1:SPI1_IRQ,SPI1_MISO,SPI1_MOSI
HBUS[0..13]
LO_VOLTAGE_BUS:LO_A[0..15],!LO_CCTL!,LO_CLK,LO_D[0..7],!LO_EXTSEL!,!LO_HALT!,!LO_IRQ!,!LO_MPD!,LO_RD4,LO_RD5,!LO_REF!,!LO_RST!,LO_R/!W!,!LO_S4!,!LO_S5!

### Notes on the sheet
- LED resistor values
- Green and Orange LEDs are configured for 20mA current
- Amber and Red LEDs are configured for 10mA current
- Orange
  LED
- Orange
  LED
- B1,2,3
  B4
  A1,2,3
  A4,5,6,7
- +5V
  Card-present
  Slot ID
  GND
- Slot id: 0,0,1
- Slot id: 0,0,0
- Slots 0,1

## Sheet 6 of 11: Expansion slots 2 & 3
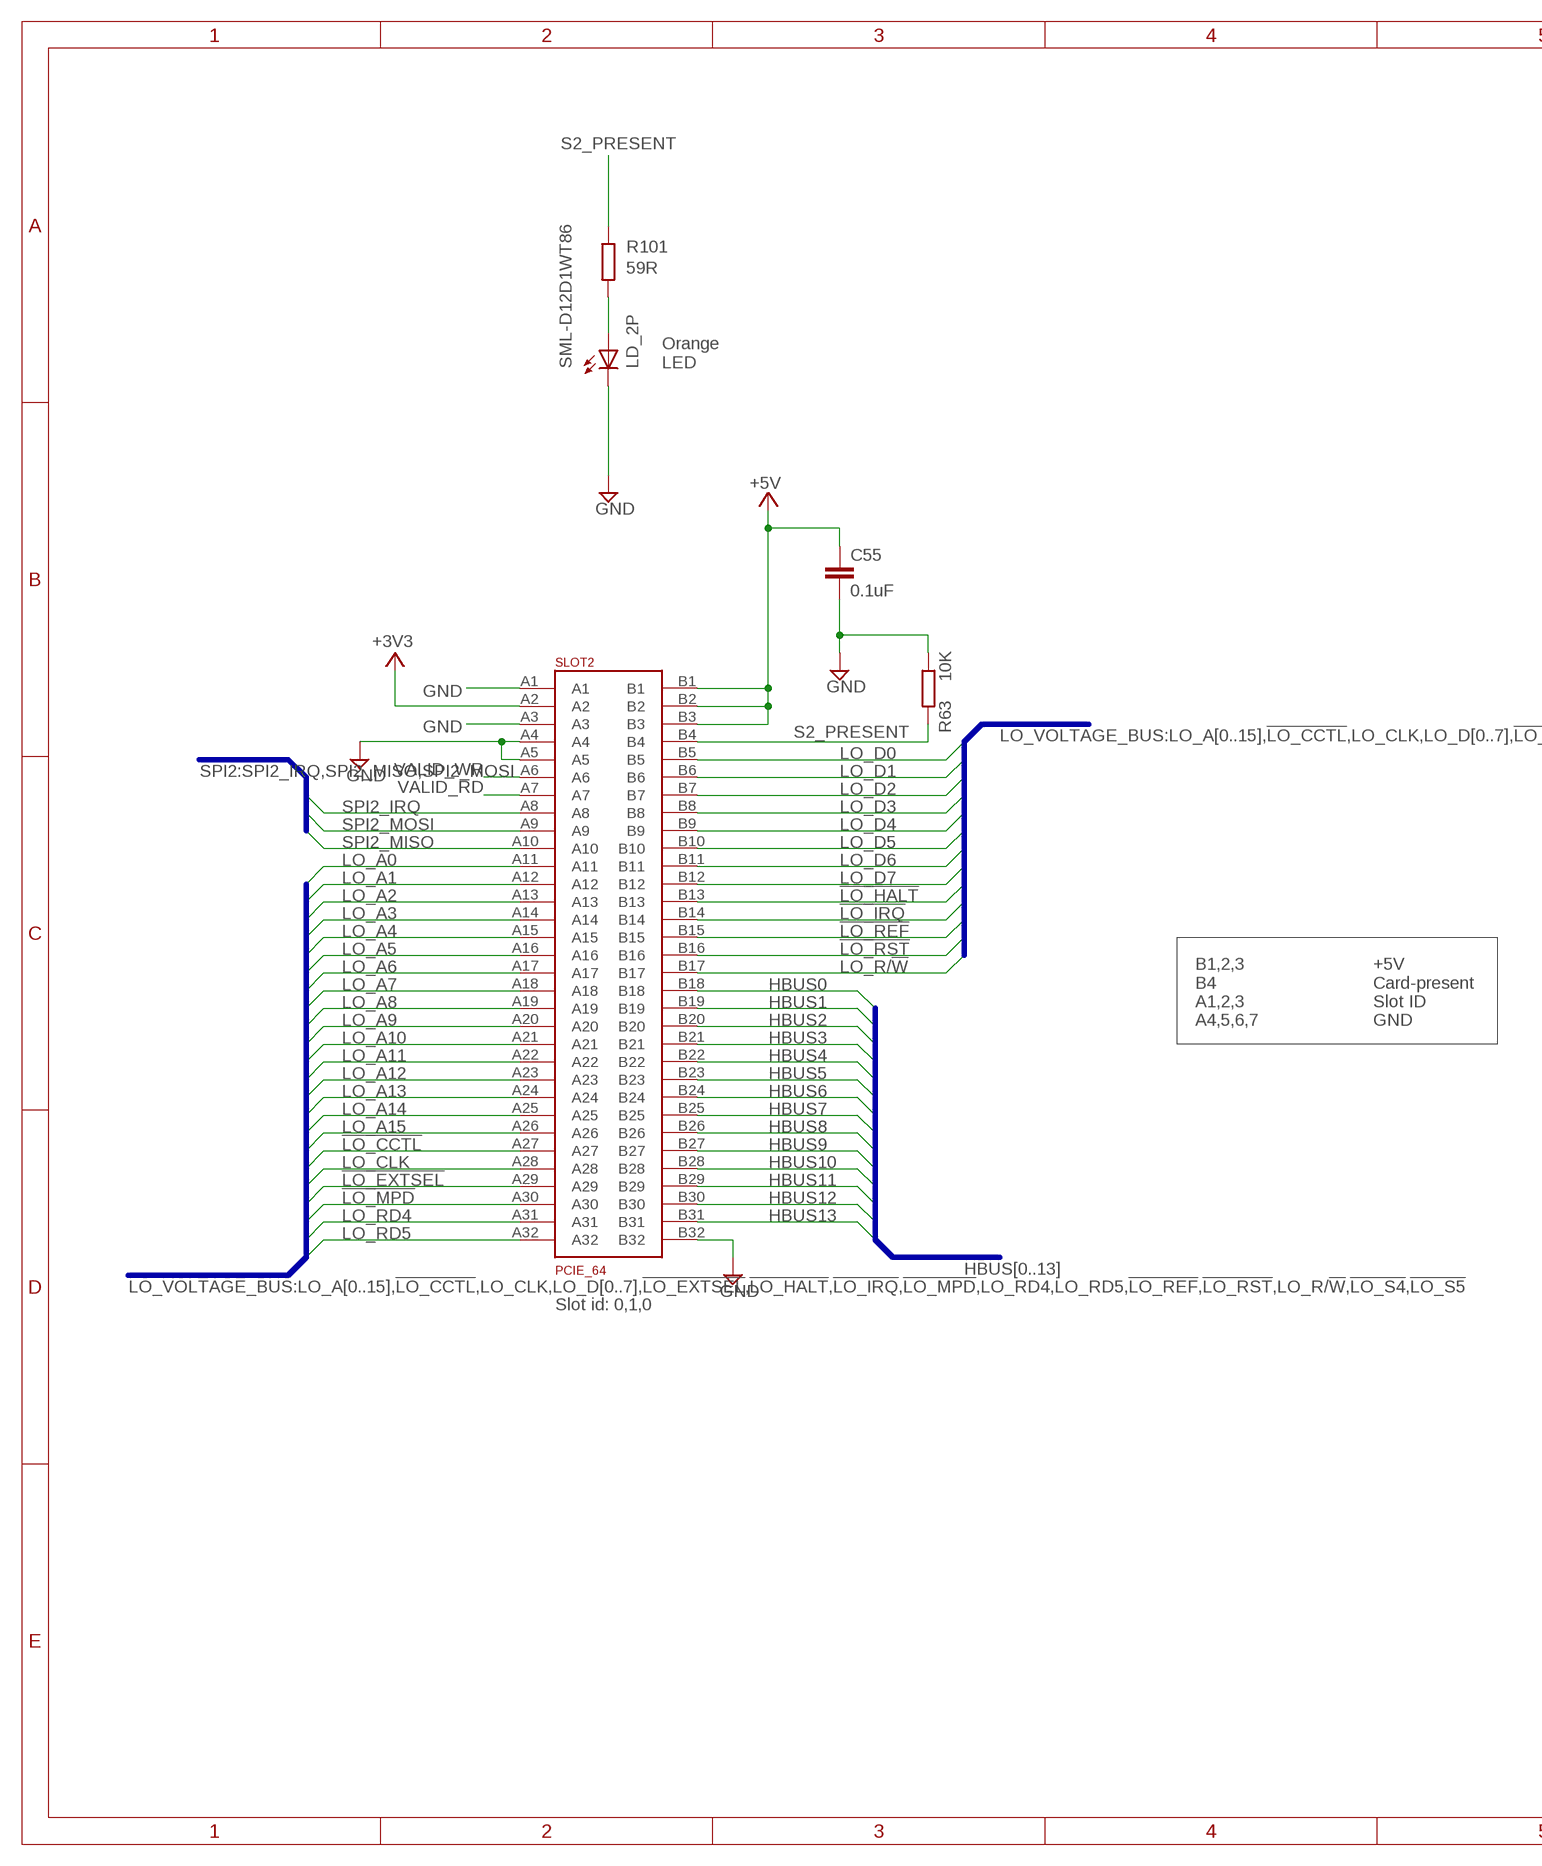
[diagram p7: schematic, sheet 6, part 1 of 2]
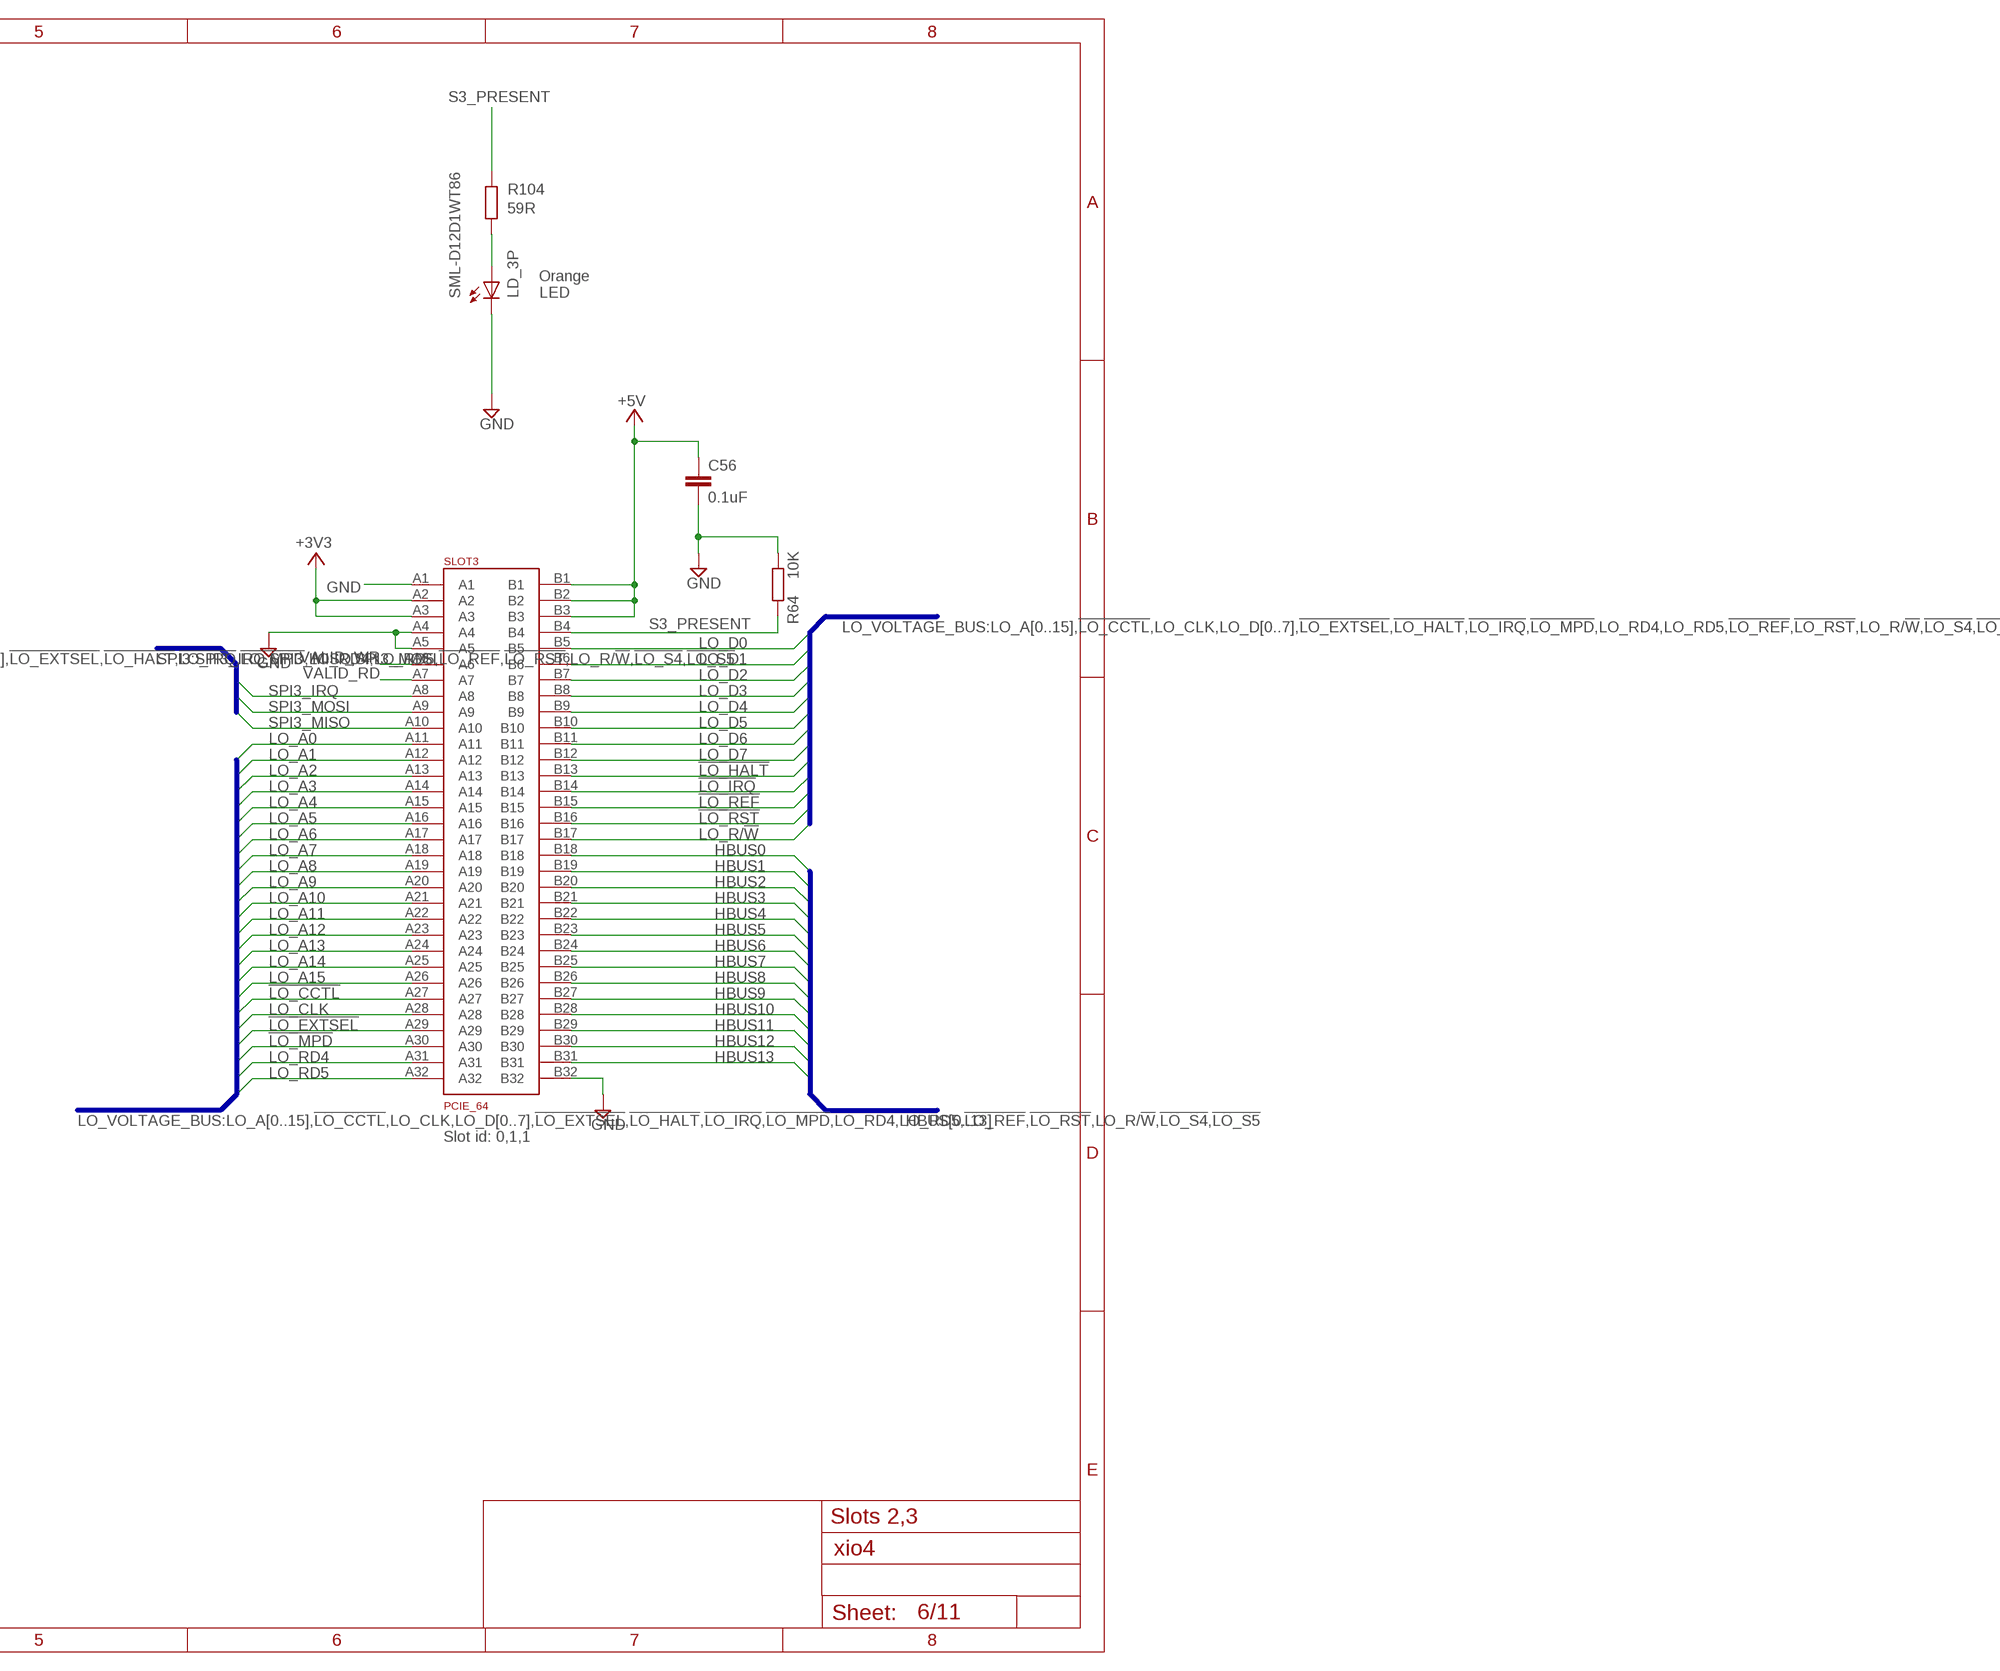
[diagram p8: schematic, sheet 6, part 2 of 2]

### Parts
C55  0.1uF  C-EUC0201  [C0201]
C56  0.1uF  C-EUC0201  [C0201]
LD_2P  SML-D12D1WT86  LEDCHIPLED_0603  [CHIPLED_0603]
LD_3P  SML-D12D1WT86  LEDCHIPLED_0603  [CHIPLED_0603]
R63  10K  R-EU_R0201  [R0201]
R64  10K  R-EU_R0201  [R0201]
R101  59R  R-EU_R0402  [R0402]
R104  59R  R-EU_R0402  [R0402]
SLOT2  PCIE_64  [PCI-E_64]
SLOT3  PCIE_64  [PCI-E_64]

### Nets
!LO_CCTL!: SLOT2.A27 SLOT3.A27 ; also sheet 5,7
!LO_EXTSEL!: SLOT2.A29 SLOT3.A29 ; also sheet 3,5,7
!LO_HALT!: SLOT2.B13 SLOT3.B13 ; also sheet 3,5,7
!LO_IRQ!: SLOT2.B14 SLOT3.B14 ; also sheet 3,5,7
!LO_MPD!: SLOT2.A30 SLOT3.A30 ; also sheet 3,5,7
!LO_REF!: SLOT2.B15 SLOT3.B15 ; also sheet 5,7
!LO_RST!: SLOT2.B16 SLOT3.B16 ; also sheet 3,5,7
+3V3 [lcd]: SLOT2.A2 SLOT3.A2 SLOT3.A3 ; also sheet 3,4,5,7,9
+5V [Power]: C55.1 C56.1 SLOT2.B1 SLOT2.B2 SLOT2.B3 SLOT3.B1 SLOT3.B2 SLOT3.B3 ; also sheet 2,3,4,5,7
GND: C55.2 C56.2 LD_2P.C LD_3P.C R63.1 R64.1 SLOT2.A1 SLOT2.A3 SLOT2.A4 SLOT2.A5 SLOT2.B32 SLOT3.A1 SLOT3.A4 SLOT3.A5 SLOT3.B32 ; also sheet 2,3,4,5,7,9
HBUS0: SLOT2.B18 SLOT3.B18 ; also sheet 5,7
HBUS1: SLOT2.B19 SLOT3.B19 ; also sheet 5,7
HBUS2: SLOT2.B20 SLOT3.B20 ; also sheet 5,7
HBUS3: SLOT2.B21 SLOT3.B21 ; also sheet 5,7
HBUS4: SLOT2.B22 SLOT3.B22 ; also sheet 5,7
HBUS5: SLOT2.B23 SLOT3.B23 ; also sheet 5,7
HBUS6: SLOT2.B24 SLOT3.B24 ; also sheet 5,7
HBUS7: SLOT2.B25 SLOT3.B25 ; also sheet 5,7
HBUS8: SLOT2.B26 SLOT3.B26 ; also sheet 5,7
HBUS9: SLOT2.B27 SLOT3.B27 ; also sheet 5,7
HBUS10: SLOT2.B28 SLOT3.B28 ; also sheet 5,7
HBUS11: SLOT2.B29 SLOT3.B29 ; also sheet 5,7
HBUS12: SLOT2.B30 SLOT3.B30 ; also sheet 5,7
HBUS13: SLOT2.B31 SLOT3.B31 ; also sheet 5,7
LO_A0: SLOT2.A11 SLOT3.A11 ; also sheet 3,5,7
LO_A1: SLOT2.A12 SLOT3.A12 ; also sheet 3,5,7
LO_A2: SLOT2.A13 SLOT3.A13 ; also sheet 3,5,7
LO_A3: SLOT2.A14 SLOT3.A14 ; also sheet 3,5,7
LO_A4: SLOT2.A15 SLOT3.A15 ; also sheet 3,5,7
LO_A5: SLOT2.A16 SLOT3.A16 ; also sheet 3,5,7
LO_A6: SLOT2.A17 SLOT3.A17 ; also sheet 3,5,7
LO_A7: SLOT2.A18 SLOT3.A18 ; also sheet 3,5,7
LO_A8: SLOT2.A19 SLOT3.A19 ; also sheet 3,5,7
LO_A9: SLOT2.A20 SLOT3.A20 ; also sheet 3,5,7
LO_A10: SLOT2.A21 SLOT3.A21 ; also sheet 3,5,7
LO_A11: SLOT2.A22 SLOT3.A22 ; also sheet 3,5,7
LO_A12: SLOT2.A23 SLOT3.A23 ; also sheet 3,5,7
LO_A13: SLOT2.A24 SLOT3.A24 ; also sheet 3,5,7
LO_A14: SLOT2.A25 SLOT3.A25 ; also sheet 3,5,7
LO_A15: SLOT2.A26 SLOT3.A26 ; also sheet 3,5,7
LO_CLK: SLOT2.A28 SLOT3.A28 ; also sheet 3,5,7
LO_D0: SLOT2.B5 SLOT3.B5 ; also sheet 3,5,7
LO_D1: SLOT2.B6 SLOT3.B6 ; also sheet 3,5,7
LO_D2: SLOT2.B7 SLOT3.B7 ; also sheet 3,5,7
LO_D3: SLOT2.B8 SLOT3.B8 ; also sheet 3,5,7
LO_D4: SLOT2.B9 SLOT3.B9 ; also sheet 3,5,7
LO_D5: SLOT2.B10 SLOT3.B10 ; also sheet 3,5,7
LO_D6: SLOT2.B11 SLOT3.B11 ; also sheet 3,5,7
LO_D7: SLOT2.B12 SLOT3.B12 ; also sheet 3,5,7
LO_R/!W!: SLOT2.B17 SLOT3.B17 ; also sheet 3,5,7
LO_RD4: SLOT2.A31 SLOT3.A31 ; also sheet 3,5,7
LO_RD5: SLOT2.A32 SLOT3.A32 ; also sheet 3,5,7
N$94: LD_2P.A R101.2
N$97: LD_3P.A R104.2
S2_PRESENT: R63.2 R101.1 SLOT2.B4
S3_PRESENT: R64.2 R104.1 SLOT3.B4
SPI2_IRQ: SLOT2.A8
SPI2_MISO: SLOT2.A10
SPI2_MOSI: SLOT2.A9
SPI3_IRQ: SLOT3.A8
SPI3_MISO: SLOT3.A10
SPI3_MOSI: SLOT3.A9
VALID_RD: SLOT2.A7 SLOT3.A7 ; also sheet 5,7
VALID_WR: SLOT2.A6 SLOT3.A6 ; also sheet 5,7

### Buses
SPI2:SPI2_IRQ,SPI2_MISO,SPI2_MOSI
SPI3:SPI3_IRQ,SPI3_MISO,SPI3_MOSI
LO_VOLTAGE_BUS:LO_A[0..15],!LO_CCTL!,LO_CLK,LO_D[0..7],!LO_EXTSEL!,!LO_HALT!,!LO_IRQ!,!LO_MPD!,LO_RD4,LO_RD5,!LO_REF!,!LO_RST!,LO_R/!W!,!LO_S4!,!LO_S5!
HBUS[0..13]

### Notes on the sheet
- Orange
  LED
- Orange
  LED
- B1,2,3
  B4
  A1,2,3
  A4,5,6,7
- +5V
  Card-present
  Slot ID
  GND
- Slot id: 0,1,1
- Slot id: 0,1,0
- Slots 2,3

## Sheet 7 of 11: Expansion slot 4
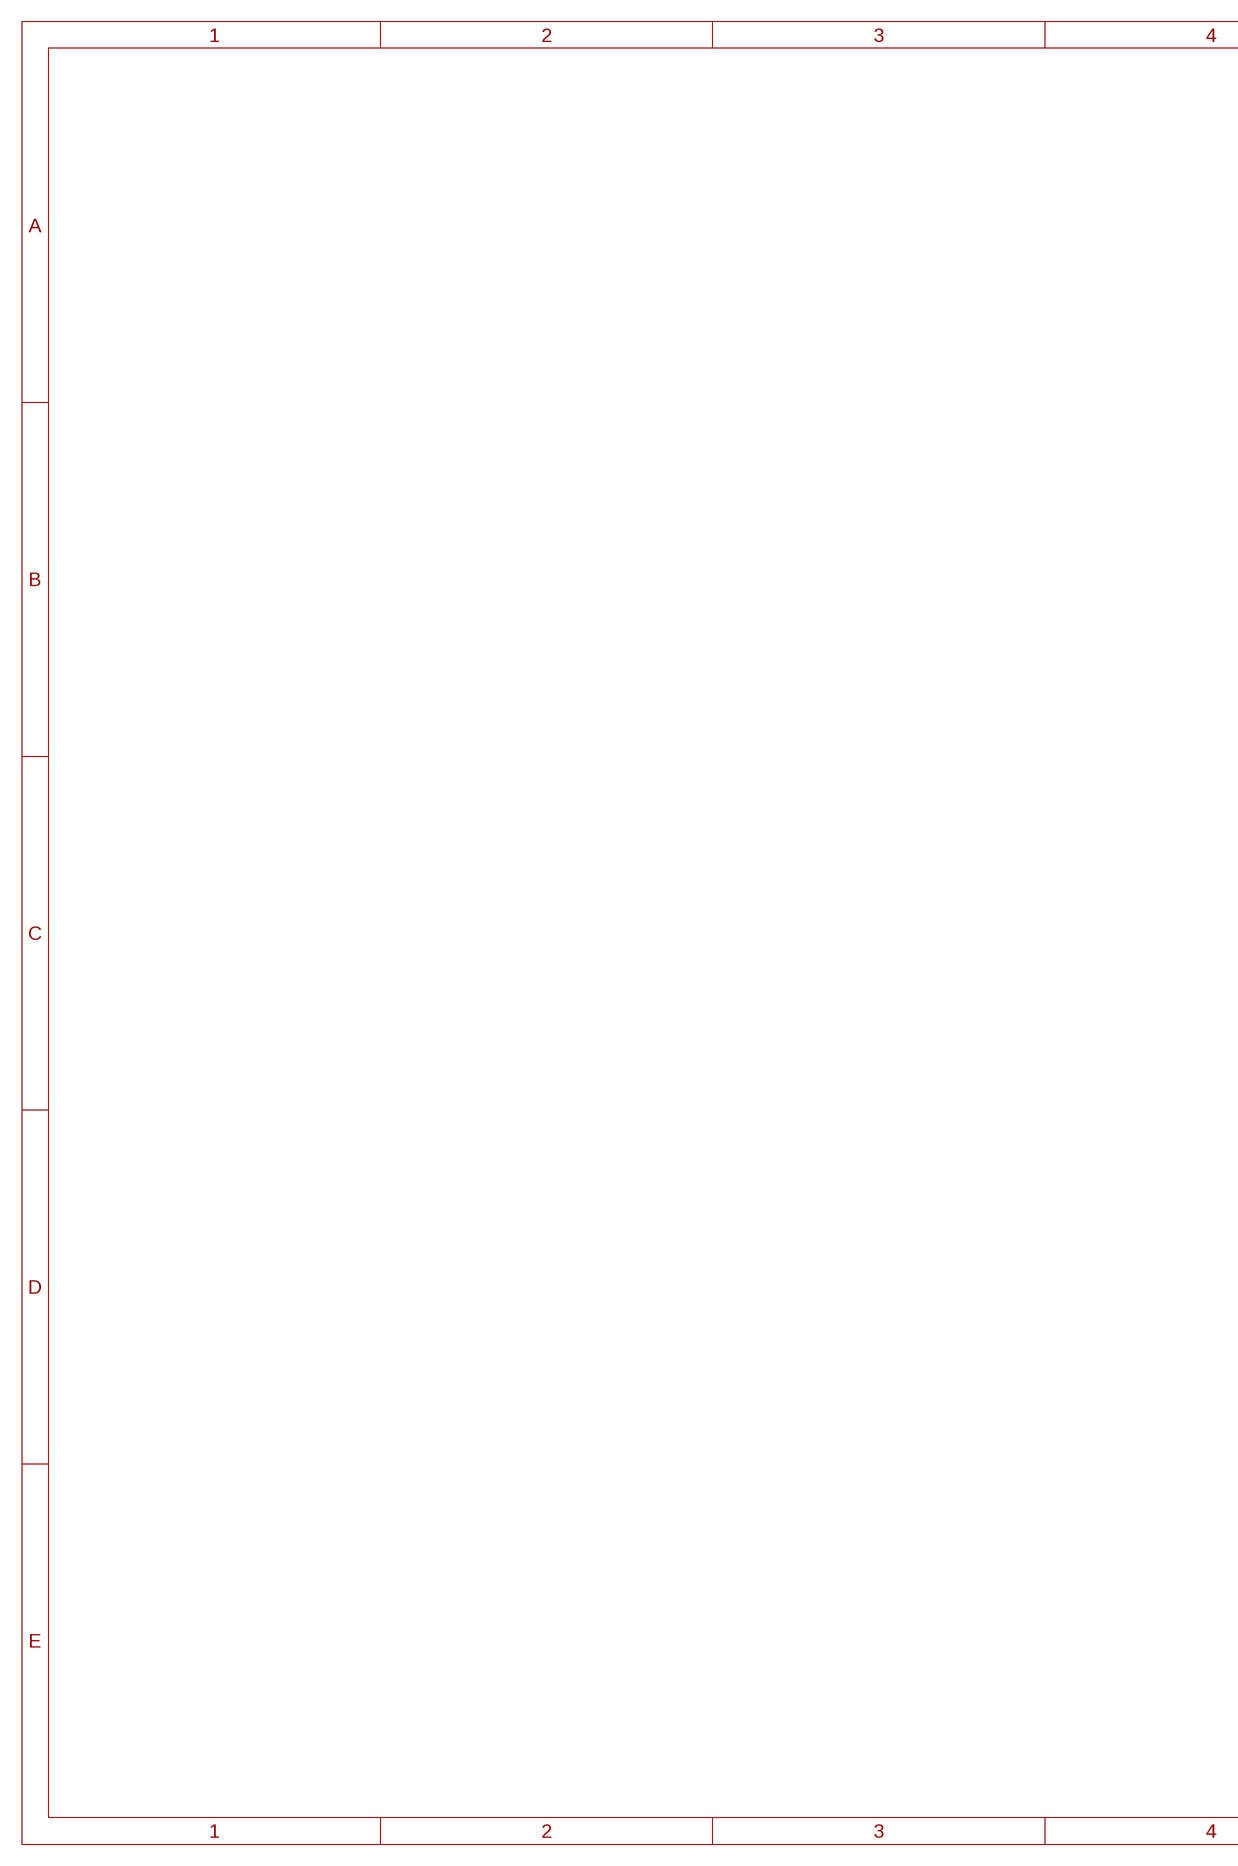
[diagram p9: schematic, sheet 7, part 1 of 2]
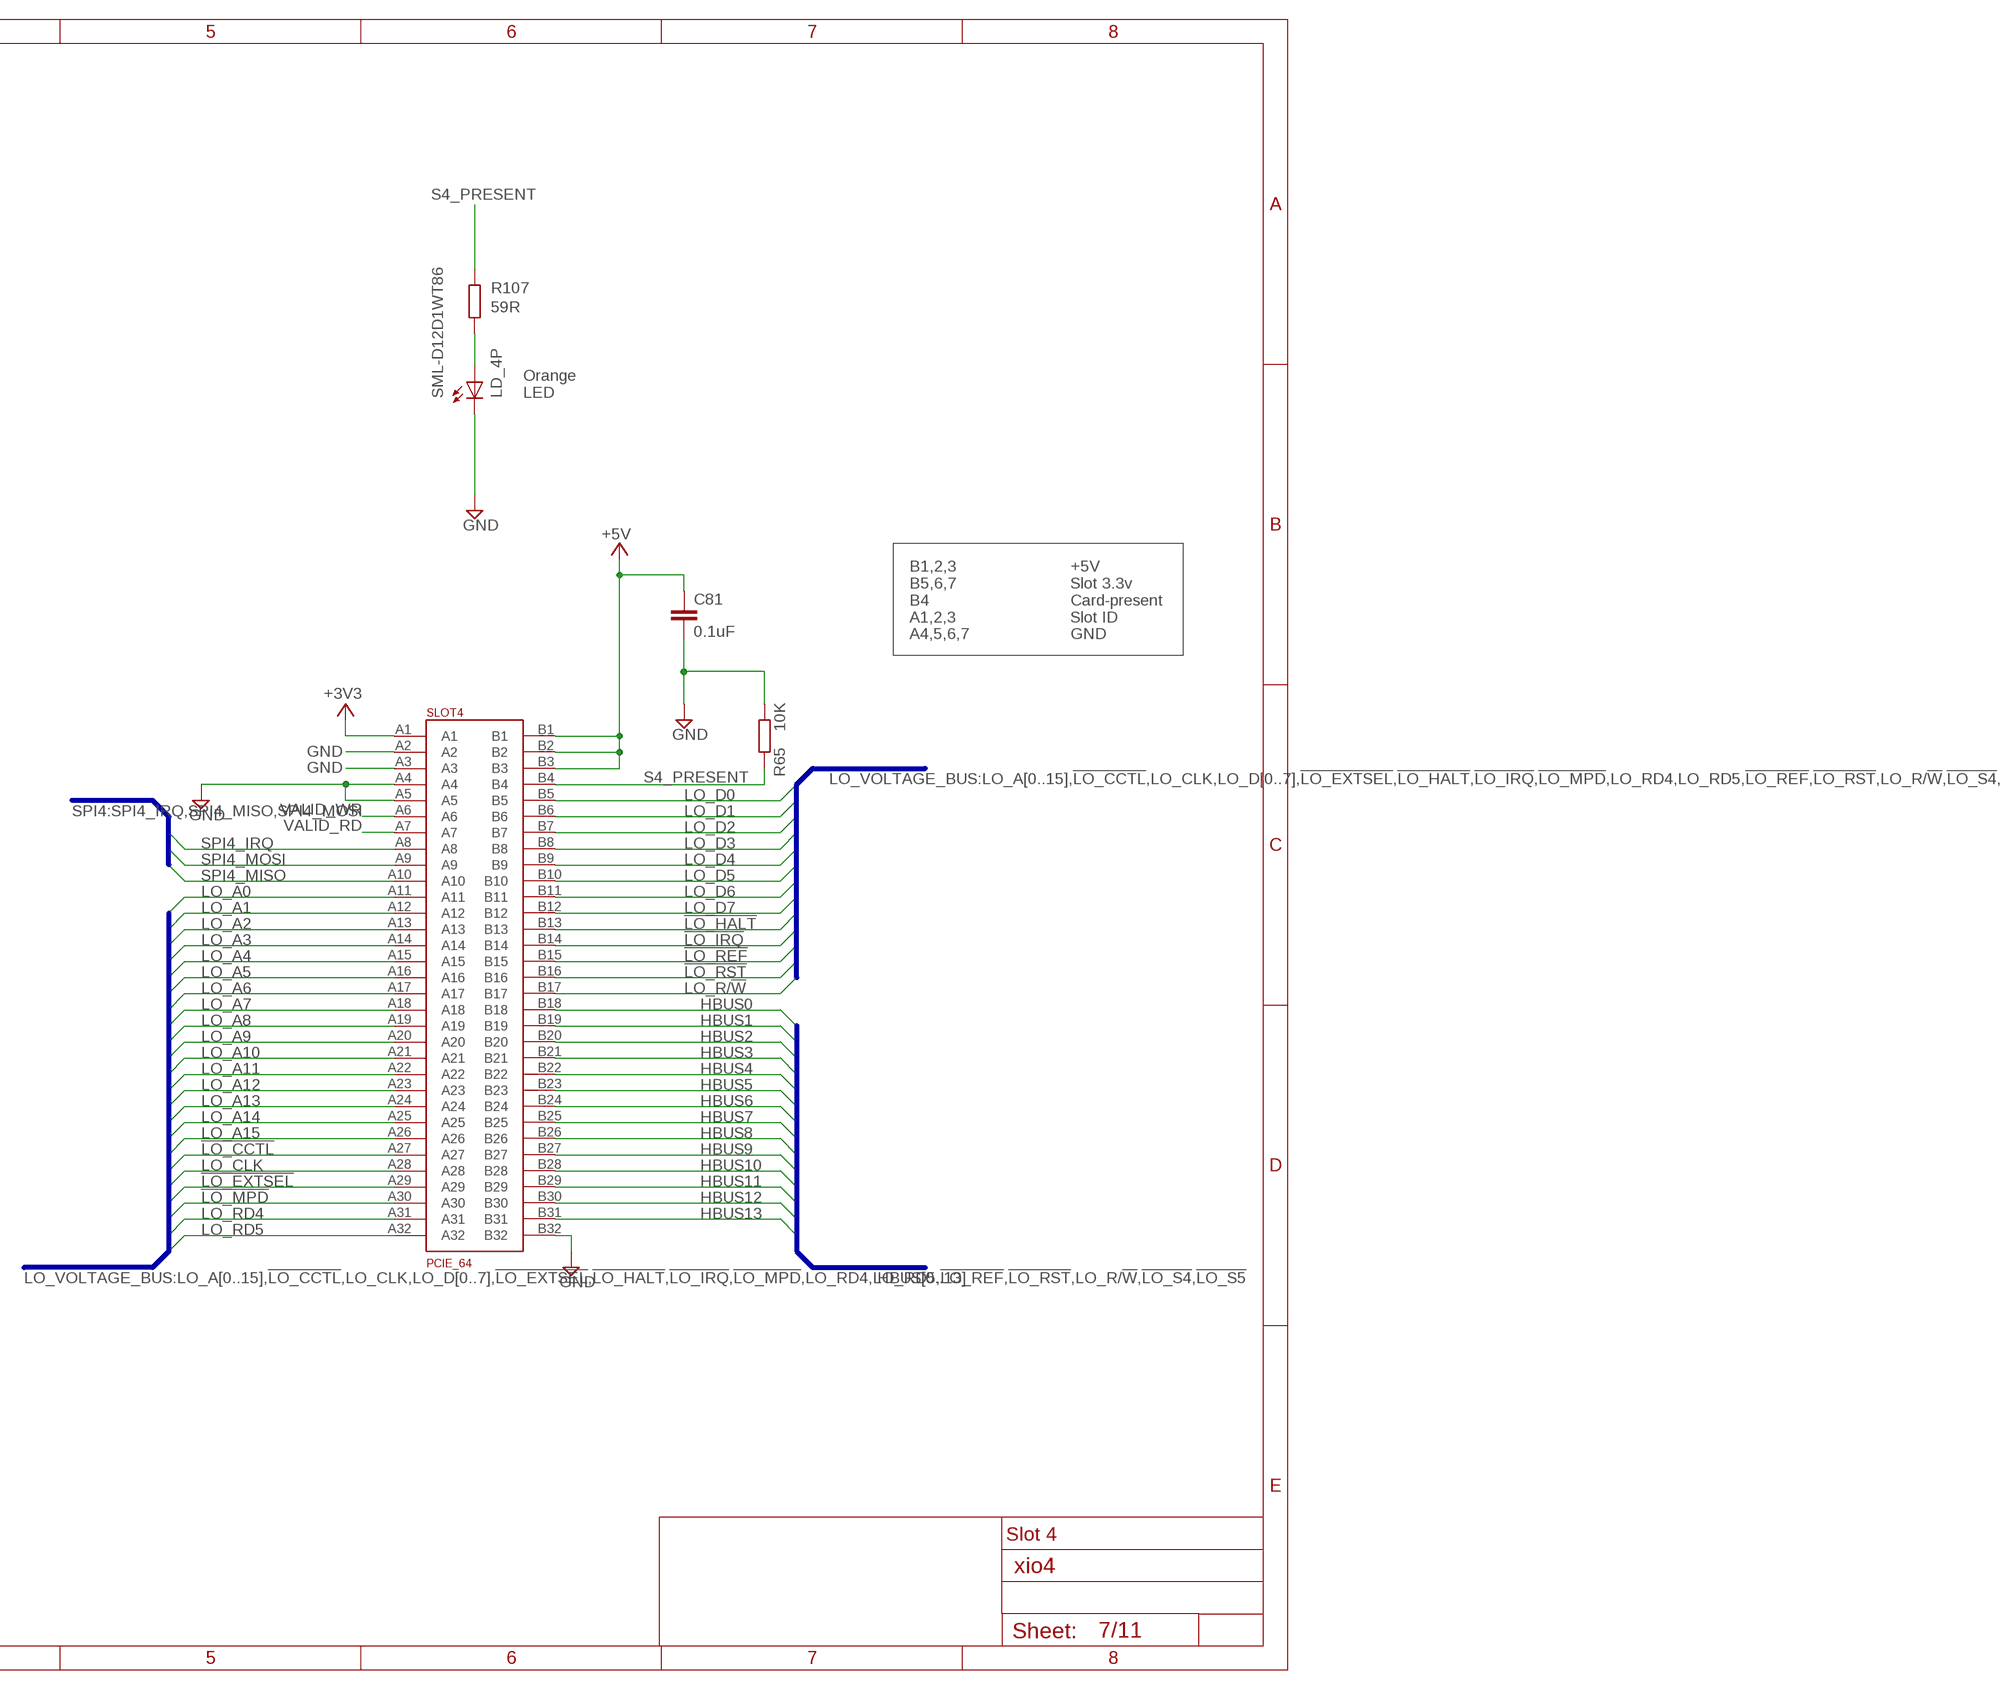
[diagram p10: schematic, sheet 7, part 2 of 2]

### Parts
C81  0.1uF  C-EUC0201  [C0201]
LD_4P  SML-D12D1WT86  LEDCHIPLED_0603  [CHIPLED_0603]
R65  10K  R-EU_R0201  [R0201]
R107  59R  R-EU_R0402  [R0402]
SLOT4  PCIE_64  [PCI-E_64]

### Nets
!LO_CCTL!: SLOT4.A27 ; also sheet 5,6
!LO_EXTSEL!: SLOT4.A29 ; also sheet 3,5,6
!LO_HALT!: SLOT4.B13 ; also sheet 3,5,6
!LO_IRQ!: SLOT4.B14 ; also sheet 3,5,6
!LO_MPD!: SLOT4.A30 ; also sheet 3,5,6
!LO_REF!: SLOT4.B15 ; also sheet 5,6
!LO_RST!: SLOT4.B16 ; also sheet 3,5,6
+3V3 [lcd]: SLOT4.A1 ; also sheet 3,4,5,6,9
+5V [Power]: C81.1 SLOT4.B1 SLOT4.B2 SLOT4.B3 ; also sheet 2,3,4,5,6
GND: C81.2 LD_4P.C R65.1 SLOT4.A2 SLOT4.A3 SLOT4.A4 SLOT4.A5 SLOT4.B32 ; also sheet 2,3,4,5,6,9
HBUS0: SLOT4.B18 ; also sheet 5,6
HBUS1: SLOT4.B19 ; also sheet 5,6
HBUS2: SLOT4.B20 ; also sheet 5,6
HBUS3: SLOT4.B21 ; also sheet 5,6
HBUS4: SLOT4.B22 ; also sheet 5,6
HBUS5: SLOT4.B23 ; also sheet 5,6
HBUS6: SLOT4.B24 ; also sheet 5,6
HBUS7: SLOT4.B25 ; also sheet 5,6
HBUS8: SLOT4.B26 ; also sheet 5,6
HBUS9: SLOT4.B27 ; also sheet 5,6
HBUS10: SLOT4.B28 ; also sheet 5,6
HBUS11: SLOT4.B29 ; also sheet 5,6
HBUS12: SLOT4.B30 ; also sheet 5,6
HBUS13: SLOT4.B31 ; also sheet 5,6
LO_A0: SLOT4.A11 ; also sheet 3,5,6
LO_A1: SLOT4.A12 ; also sheet 3,5,6
LO_A2: SLOT4.A13 ; also sheet 3,5,6
LO_A3: SLOT4.A14 ; also sheet 3,5,6
LO_A4: SLOT4.A15 ; also sheet 3,5,6
LO_A5: SLOT4.A16 ; also sheet 3,5,6
LO_A6: SLOT4.A17 ; also sheet 3,5,6
LO_A7: SLOT4.A18 ; also sheet 3,5,6
LO_A8: SLOT4.A19 ; also sheet 3,5,6
LO_A9: SLOT4.A20 ; also sheet 3,5,6
LO_A10: SLOT4.A21 ; also sheet 3,5,6
LO_A11: SLOT4.A22 ; also sheet 3,5,6
LO_A12: SLOT4.A23 ; also sheet 3,5,6
LO_A13: SLOT4.A24 ; also sheet 3,5,6
LO_A14: SLOT4.A25 ; also sheet 3,5,6
LO_A15: SLOT4.A26 ; also sheet 3,5,6
LO_CLK: SLOT4.A28 ; also sheet 3,5,6
LO_D0: SLOT4.B5 ; also sheet 3,5,6
LO_D1: SLOT4.B6 ; also sheet 3,5,6
LO_D2: SLOT4.B7 ; also sheet 3,5,6
LO_D3: SLOT4.B8 ; also sheet 3,5,6
LO_D4: SLOT4.B9 ; also sheet 3,5,6
LO_D5: SLOT4.B10 ; also sheet 3,5,6
LO_D6: SLOT4.B11 ; also sheet 3,5,6
LO_D7: SLOT4.B12 ; also sheet 3,5,6
LO_R/!W!: SLOT4.B17 ; also sheet 3,5,6
LO_RD4: SLOT4.A31 ; also sheet 3,5,6
LO_RD5: SLOT4.A32 ; also sheet 3,5,6
N$101: LD_4P.A R107.2
S4_PRESENT: R65.2 R107.1 SLOT4.B4
SPI4_IRQ: SLOT4.A8
SPI4_MISO: SLOT4.A10
SPI4_MOSI: SLOT4.A9
VALID_RD: SLOT4.A7 ; also sheet 5,6
VALID_WR: SLOT4.A6 ; also sheet 5,6

### Buses
SPI4:SPI4_IRQ,SPI4_MISO,SPI4_MOSI
LO_VOLTAGE_BUS:LO_A[0..15],!LO_CCTL!,LO_CLK,LO_D[0..7],!LO_EXTSEL!,!LO_HALT!,!LO_IRQ!,!LO_MPD!,LO_RD4,LO_RD5,!LO_REF!,!LO_RST!,LO_R/!W!,!LO_S4!,!LO_S5!
HBUS[0..13]

### Notes on the sheet
- Orange
  LED
- B1,2,3
  B5,6,7
  B4
  A1,2,3
  A4,5,6,7
- +5V
  Slot 3.3v
  Card-present
  Slot ID
  GND
- Slot 4

## Sheet 8 of 11: Video out
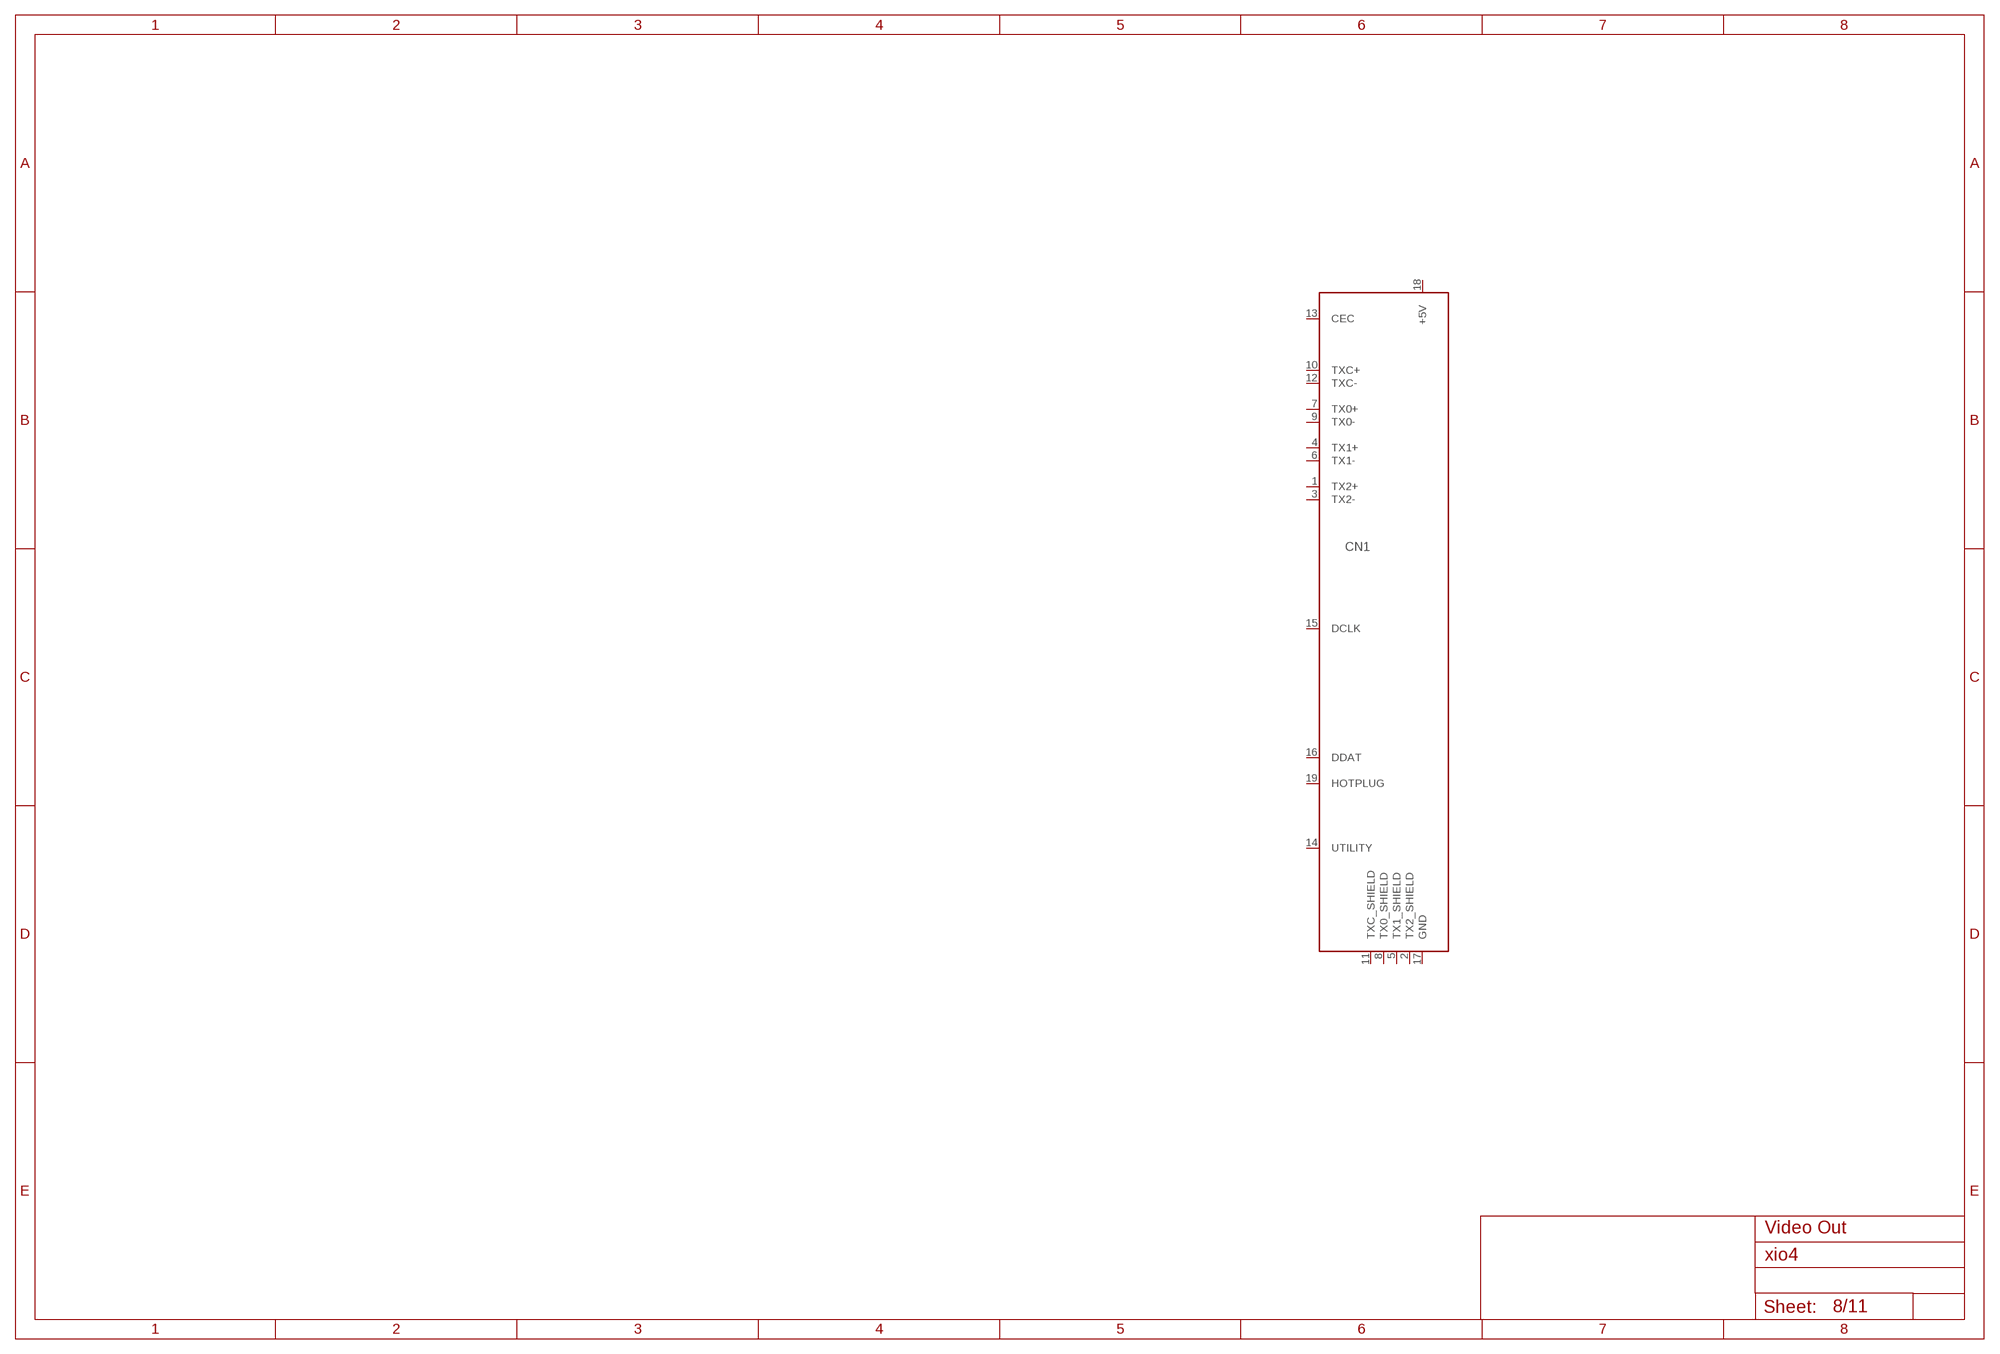
[diagram p11: schematic, sheet 8]

### Parts
CN1  HDMI_MOLEX_47151-0001  [HDMI_MOLEX_47151-0001]
Unconnected: CN1.1(TX2+) CN1.3(TX2-) CN1.4(TX1+) CN1.6(TX1-) CN1.7(TX0+) CN1.9(TX0-) CN1.10(TXC+) CN1.12(TXC-) CN1.13(CEC) CN1.14(UTILITY) CN1.15(DCLK) CN1.16(DDAT) CN1.19(HOTPLUG)

### Notes on the sheet
- Video Out

## Sheet 9 of 11: Board config & Serial
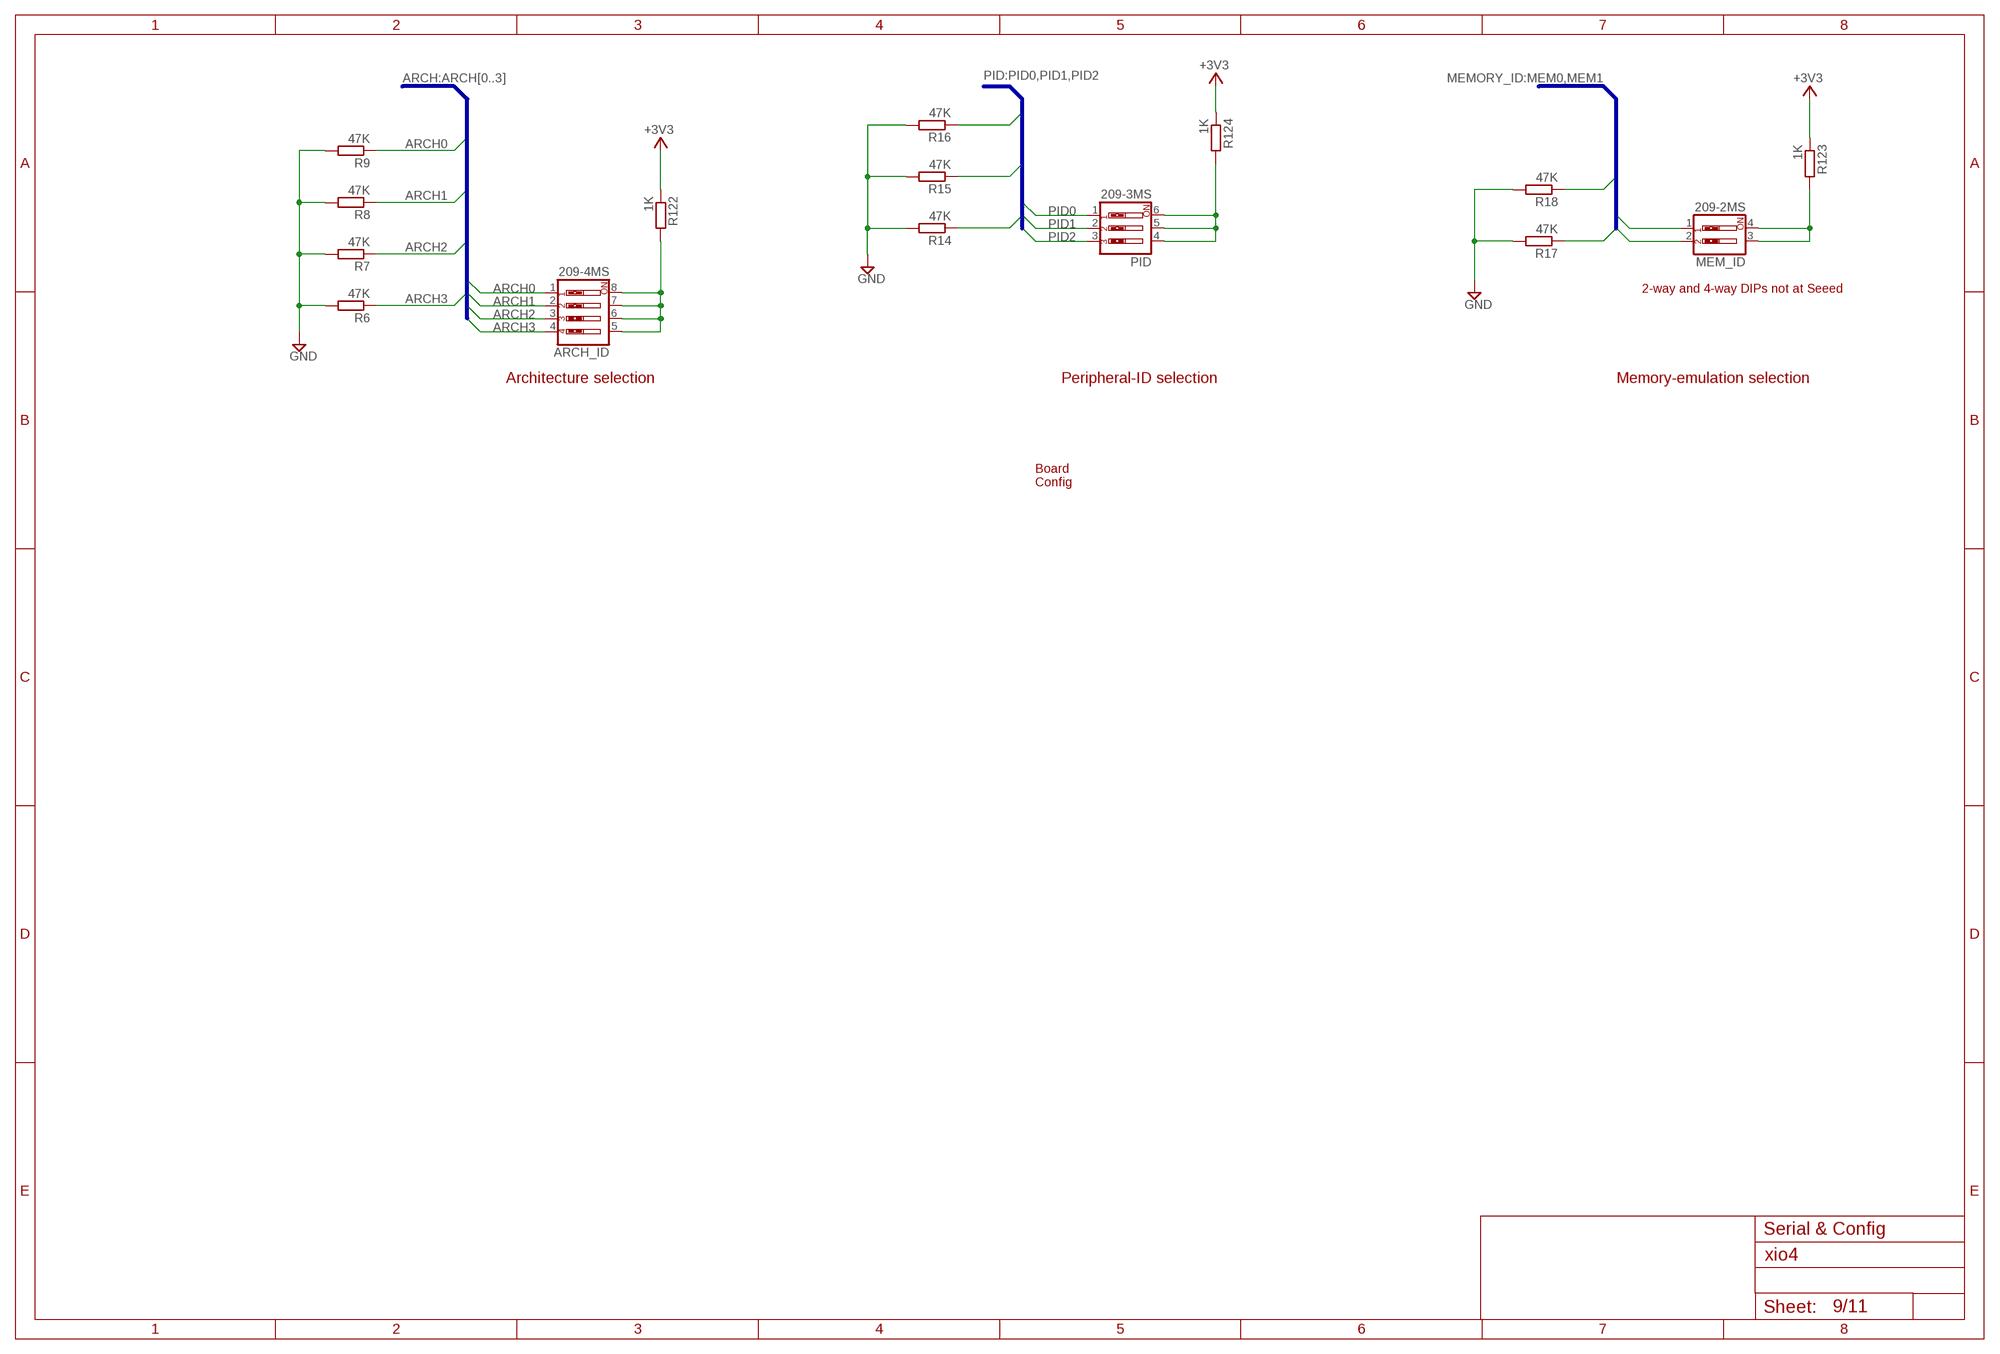
[diagram p12: schematic, sheet 9]

### Parts
ARCH_ID  209-4MS  SW_DIP-4  [EDG-04]
MEM_ID  209-2MS  SW_DIP-2  [EDG-02]
PID  209-3MS  SW_DIP-3  [EDG-03]
R6  47K  R-EU_R0201  [R0201]
R7  47K  R-EU_R0201  [R0201]
R8  47K  R-EU_R0201  [R0201]
R9  47K  R-EU_R0201  [R0201]
R14  47K  R-EU_R0201  [R0201]
R15  47K  R-EU_R0201  [R0201]
R16  47K  R-EU_R0201  [R0201]
R17  47K  R-EU_R0201  [R0201]
R18  47K  R-EU_R0201  [R0201]
R122  1K  R-EU_R0201  [R0201]
R123  1K  R-EU_R0201  [R0201]
R124  1K  R-EU_R0201  [R0201]

### Nets
+3V3 [lcd]: R122.1 R123.1 R124.1 ; also sheet 3,4,5,6,7
ARCH0: ARCH_ID.1 R9.1
ARCH1: ARCH_ID.2 R8.1
ARCH2: ARCH_ID.3 R7.1
ARCH3: ARCH_ID.4 R6.1
GND: R6.2 R7.2 R8.2 R9.2 R14.2 R15.2 R16.2 R17.2 R18.2 ; also sheet 2,3,4,5,6,7
MEM0: MEM_ID.1 R18.1
MEM1: MEM_ID.2 R17.1
N$11 [lcd]: ARCH_ID.5 ARCH_ID.6 ARCH_ID.7 ARCH_ID.8 R122.2
N$48 [lcd]: MEM_ID.3 MEM_ID.4 R123.2
N$49 [lcd]: PID.4 PID.5 PID.6 R124.2
PID0: PID.1 R16.1
PID1: PID.2 R15.1
PID2: PID.3 R14.1

### Buses
PID:PID0,PID1,PID2
MEMORY_ID:MEM0,MEM1
ARCH:ARCH[0..3]

### Notes on the sheet
- 2-way and 4-way DIPs not at Seeed
- Architecture selection | Peripheral-ID selection | Memory-emulation selection
- Board
  Config
- Serial & Config

## Sheet 10 of 11
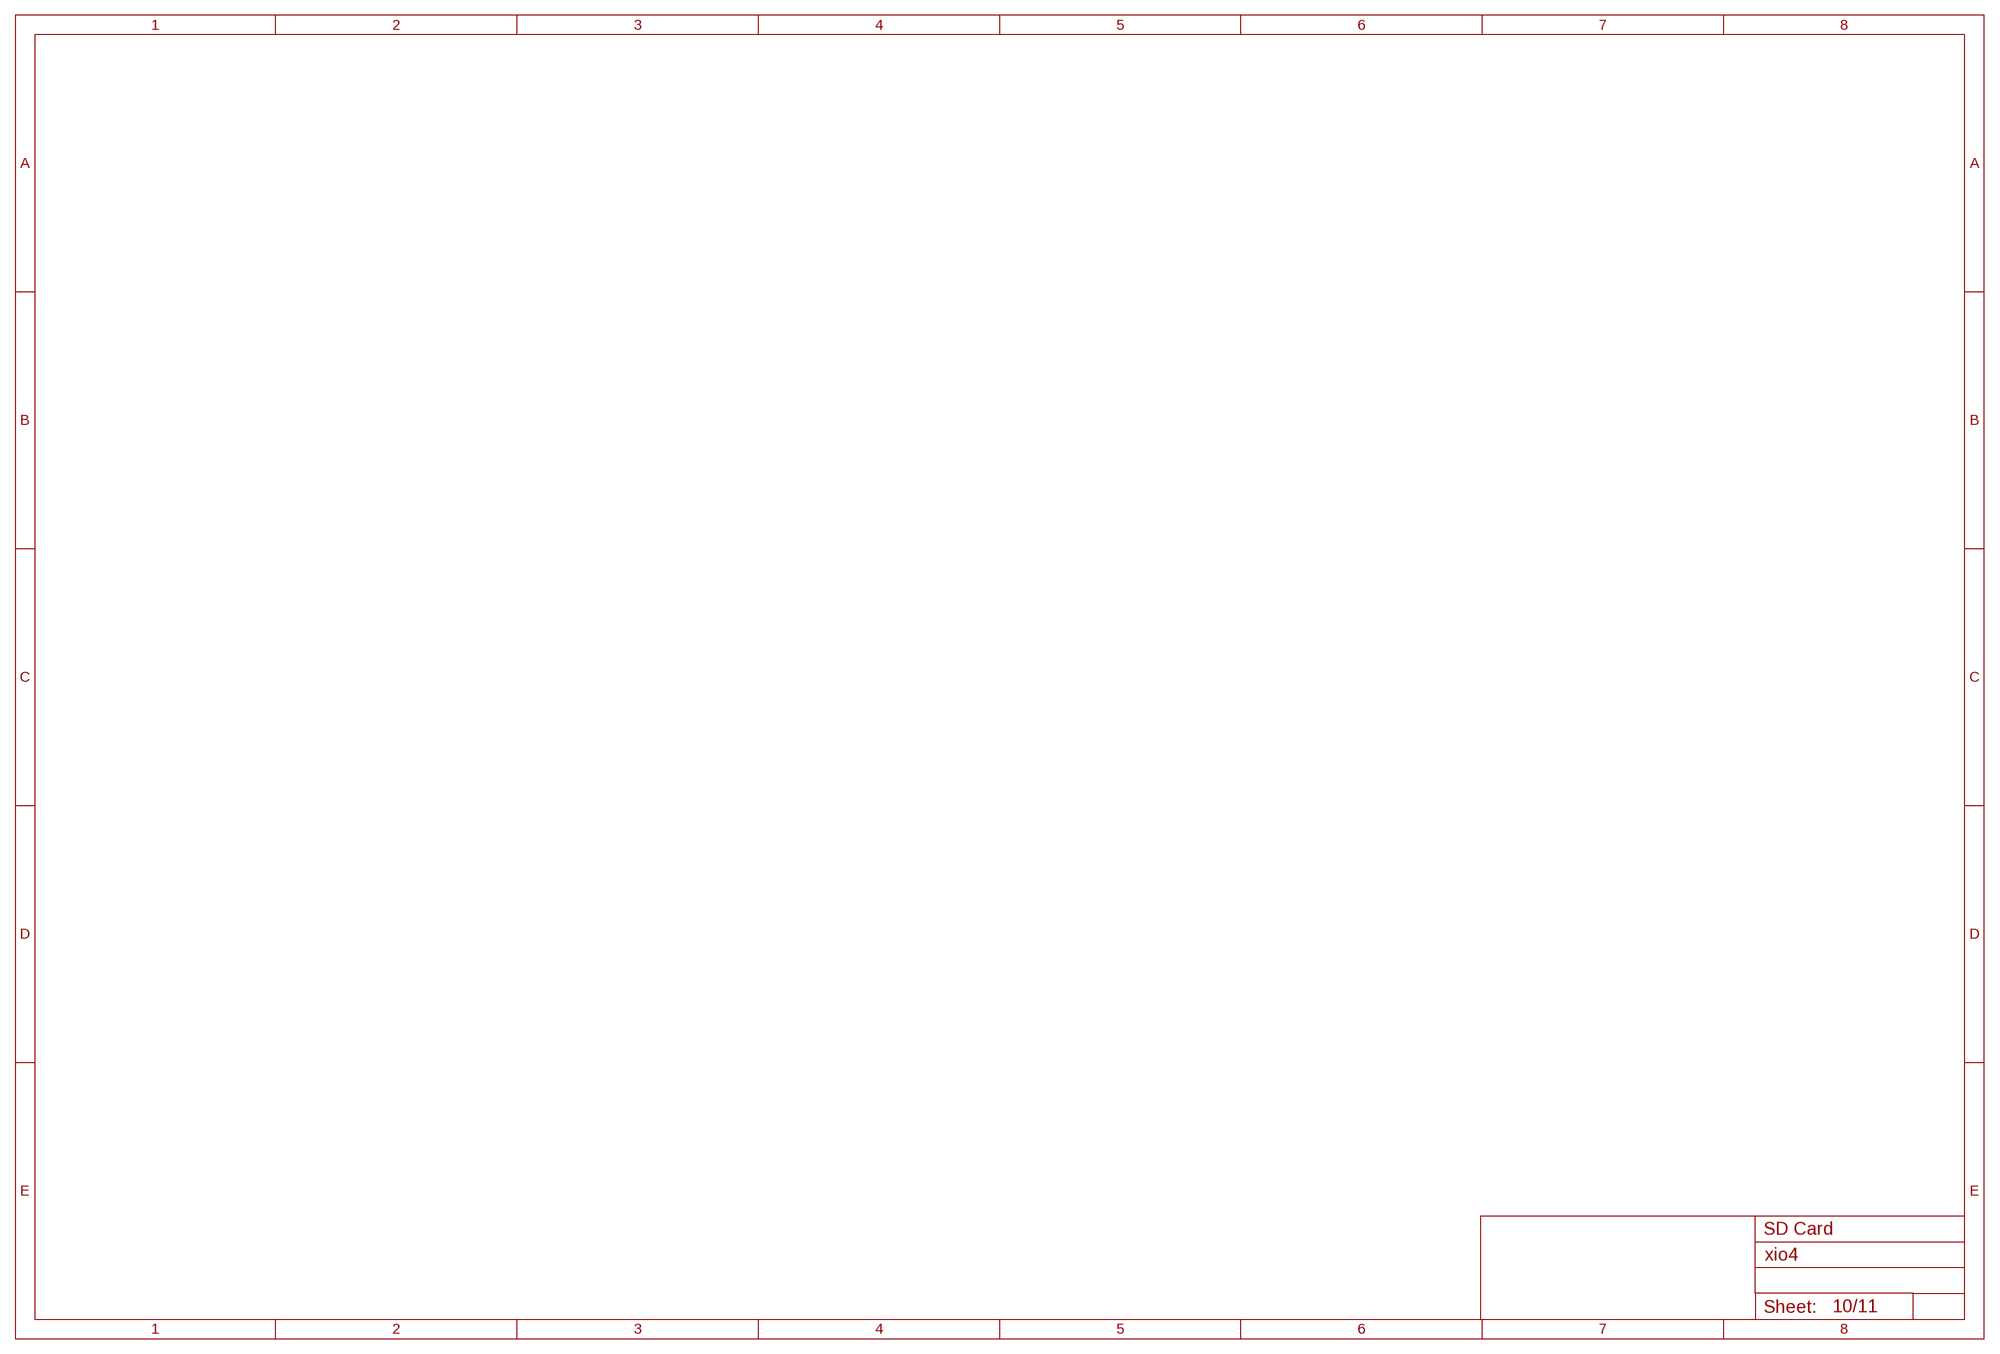
[diagram p13: schematic, sheet 10]

### Notes on the sheet
- SD Card

## Sheet 11 of 11

## Power pins joined to a net without a drawn wire
+5V: CN1.18(+5V)
GND: CN1.17(GND) CN1.P$1(GND) CN1.P$2(GND) CN1.P$3(GND) CN1.P$4(GND)
TX0_SHIELD: CN1.8(TX0_SHIELD)
TX1_SHIELD: CN1.5(TX1_SHIELD)
TX2_SHIELD: CN1.2(TX2_SHIELD)
TXC_SHIELD: CN1.11(TXC_SHIELD)

## Library data of the parts
ARCH_ID = special:SW_DIP-4: DIP SWITCH; USE: 209-4MS
C1-C6 C8 C9 C11-C18 C53-C57 C60 C63 C65 C67 C68 C71 C72 C81 = rcl:C-EU: CAPACITOR, European symbol; SPICEPREFIX: C; USE: GRM033C71C104KE14D
CARTRIDGE = sjg-con:A8_CART; USE: 5650118-1
CN1 = microbuilder:HDMI_MOLEX_47151-0001
H3 H6-H8 = holes:MOUNT-HOLE: MOUNTING HOLE with drill center marker
JP1 = pinhead:PINHD-2X25: PIN HEADER
LD_0P1 LD_1P LD_2P LD_3P LD_4P = led:LED: LED OSRAM: - CHIPLED LG R971, LG N971, LY N971, LG Q971, LY Q971, LO R971, LY R971 LH N974, LH R974 LS Q976, LO Q976, LY Q976 LO Q996 - Hyper CHIPLED LW Q18S LB Q993, LB Q99A, LB R99A - SideLED LS A670, LO A670, LY A670, LG A670, LP A670 LB A673, LV A673, LT A673, LW A673 LH A674 LY A675 LS A676, LA A676, LO A676, LY A676, LW A676 LS A679, LY A679, LG A679 - Hyper Micro SIDELED® LS Y876, LA Y876, LO Y876, LY Y876 LT Y87S - SmartLED LW L88C, LW L88S LB L89C, LB L89S, LG L890 LS L89K, LO L89K, LY L89K LS L896, LA L896, LO L896, LY L896 - TOPLED LS T670, LO T670, LY T670, LG T670, LP T670 LSG T670, LSP T670, LSY T670, LOP T670, LYG T670 LG T671, LOG T671, LSG T671 LB T673, LV T673, LT T673, LW T673 LH T674 LS T676, LA T676, LO T676, LY T676, LB T676, LH T676, LSB T676, LW T676 LB T67C, LV T67C, LT T67C, LS T67K, LO T67K, LY T67K, LW E67C LS E67B, LA E67B, LO E67B, LY E67B, LB E67C, LV E67C, LT E67C LW T67C LS T679, LY T679, LG T679 LS T770, LO T770, LY T770, LG T770, LP T770 LB T773, LV T773, LT T773, LW T773 LH T774 LS E675, LA E675, LY E675, LS T675 LS T776, LA T776, LO T776, LY T776, LB T776 LHGB T686 LT T68C, LB T68C - Hyper Mini TOPLED® LB M676 - Mini TOPLED Santana® LG M470 LS M47K, LO M47K, LY M47K Source: http://www.osram.convergy.de LUXEON: - LUMILED® LXK2-PW12-R00, LXK2-PW12-S00, LXK2-PW14-U00, LXK2-PW14-V00 LXK2-PM12-R00, LXK2-PM12-S00, LXK2-PM14-U00 LXK2-PE12-Q00, LXK2-PE12-R00, LXK2-PE12-S00, LXK2-PE14-T00, LXK2-PE14-U00 LXK2-PB12-K00, LXK2-PB12-L00, LXK2-PB12-M00, LXK2-PB14-N00, LXK2-PB14-P00, LXK2-PB14-Q00 LXK2-PR12-L00, LXK2-PR12-M00, LXK2-PR14-Q00, LXK2-PR14-R00 LXK2-PD12-Q00, LXK2-PD12-R00, LXK2-PD12-S00 LXK2-PH12-R00, LXK2-PH12-S00 LXK2-PL12-P00, LXK2-PL12-Q00, LXK2-PL12-R00 Source: www.luxeon.com KINGBRIGHT: KA-3528ASYC Source: www.kingbright.com; USE: SML-D12D1WT86
LVL_AHI LVL_ALO LVL_D = sjg-logic:SN74LVC8T245; USE: SN74LVC8T245PWR
MEM_ID = special:SW_DIP-2: DIP SWITCH; USE: 209-2MS
PID = special:SW_DIP-3: DIP SWITCH; USE: 209-3MS
R2-R5 R10 R13 R19 R21 R22 R25 R26 R61-R65 = rcl:R-EU_: RESISTOR, European symbol; SPICEPREFIX: R; USE: ERJ-1GNJ103C
R6-R9 R14-R18 = rcl:R-EU_: RESISTOR, European symbol; SPICEPREFIX: R; USE: RMCF0201JT47K0
R27 R98 R101 R104 R107 = rcl:R-EU_: RESISTOR, European symbol; SPICEPREFIX: R; USE: RMCF0402FT59R0
R122-R124 = rcl:R-EU_: RESISTOR, European symbol; SPICEPREFIX: R; USE: RC0201JR-071KL
SLOT0 SLOT1-SLOT4 = pcie:PCIE_64; USE: 10018783-10201TLF
U$3 = sjg-con:MINI-SAS: Mini-SAS connector, right angle through hole Part 1888019-4 Digikey part A111092CT-ND
U$4-U$6 U$8 U$9 U$14-U$17 = sjg-logic:74LVC1T45GW; USE: 74LVCH1T45GS,132

## Net classes
1 Power: width 0.305 mm, drill 0.203 mm
2 Slot-power: width 0.508 mm
3 tx100: width 0.254 mm, clearance 0.457 mm
4 usb90: width 0.254 mm, clearance 0.178 mm
5 cclk50: width 0.203 mm
6 3v3: width 0.254 mm
7 vccint_aux: width 0.305 mm
14 qspi: width 0.203 mm